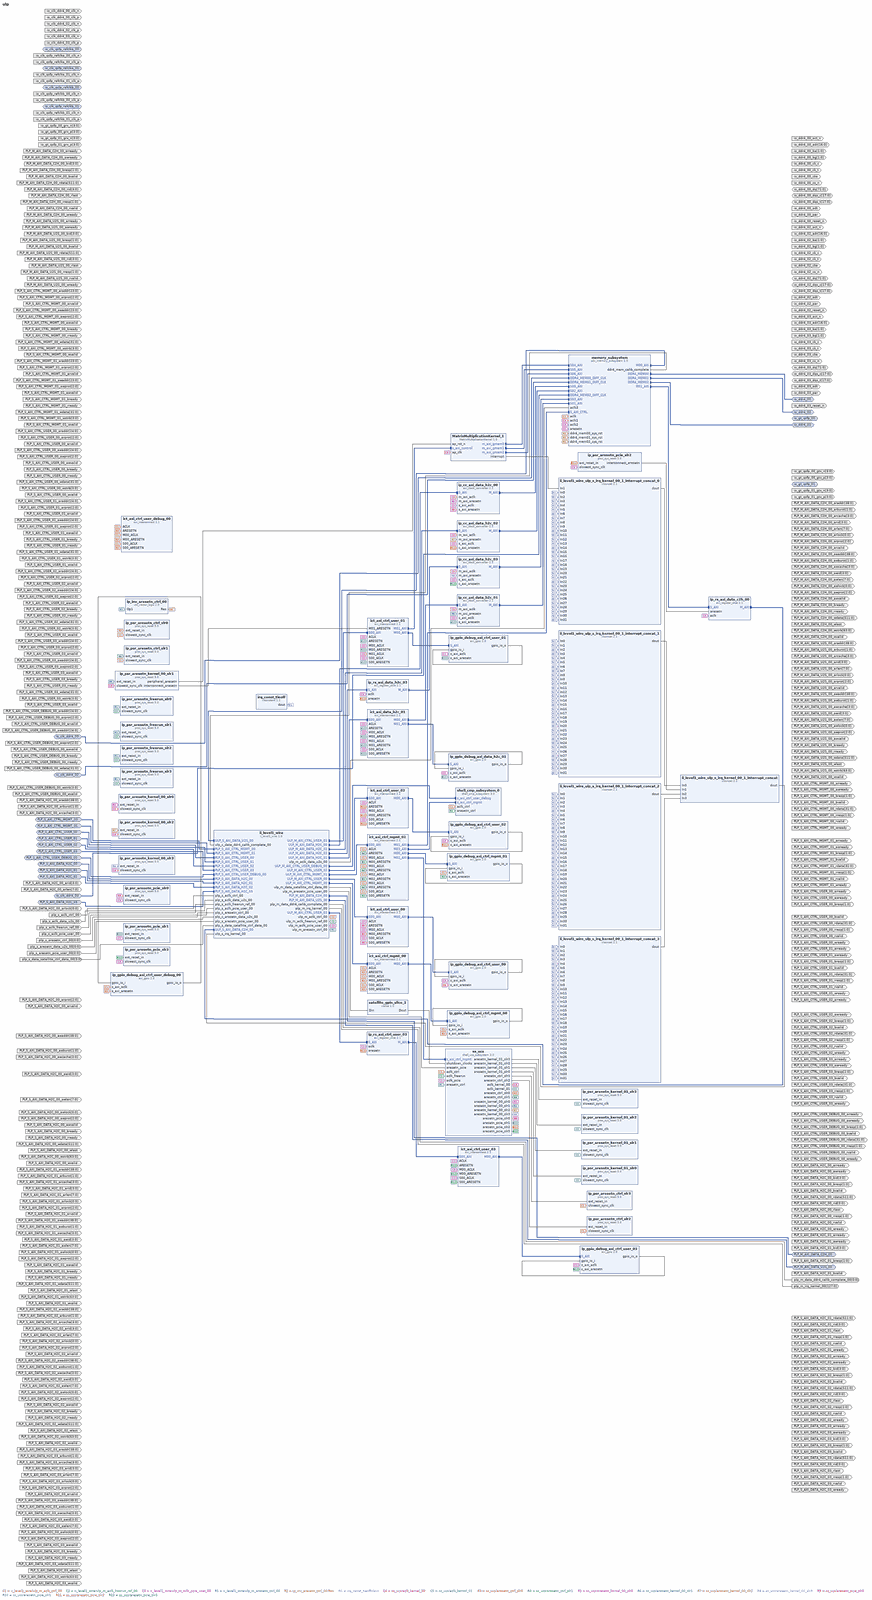
[diagram p0: block diagram of the top level, whole]
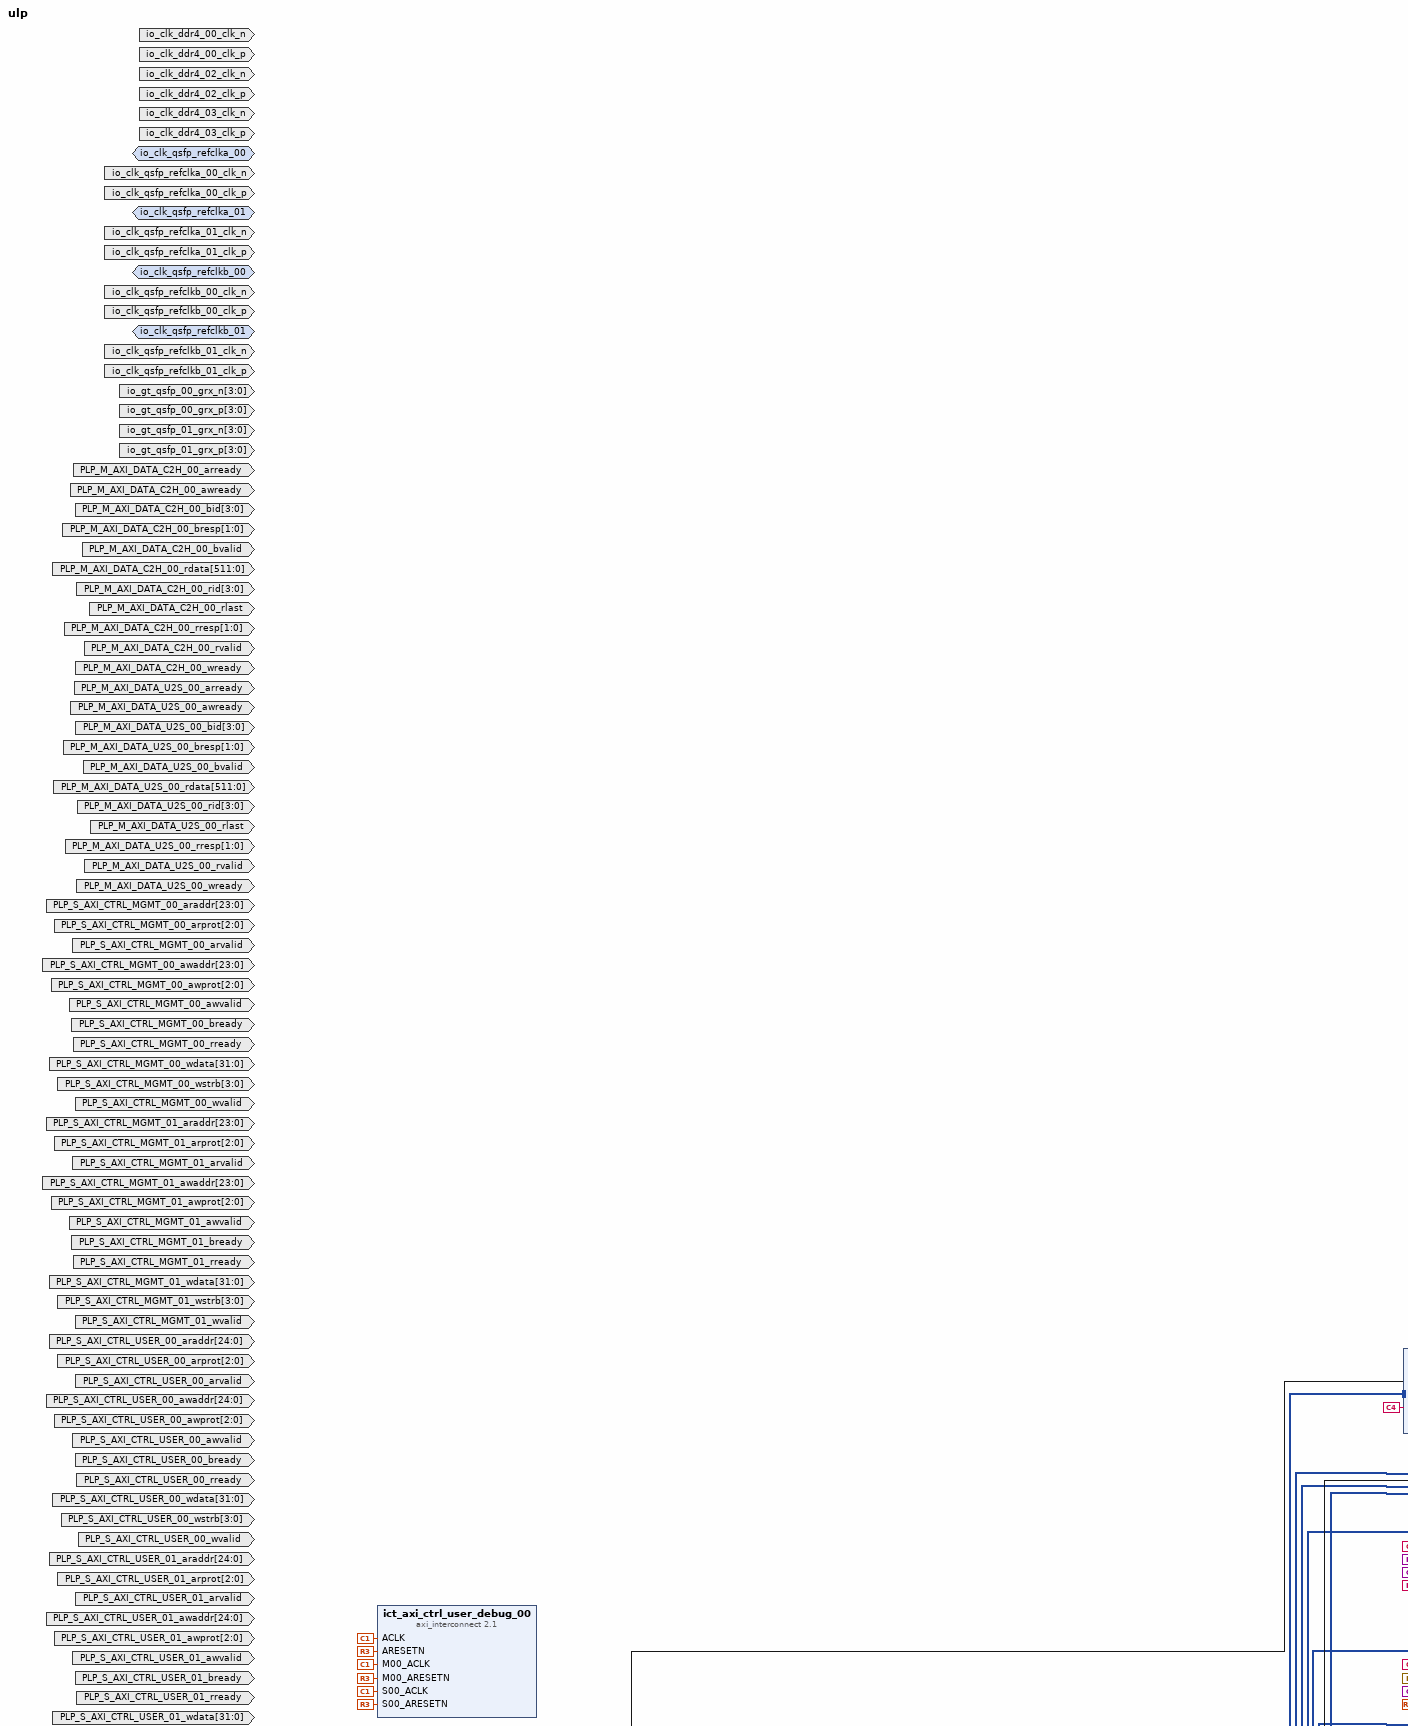
[diagram p1: block diagram of the top level, upper left part]
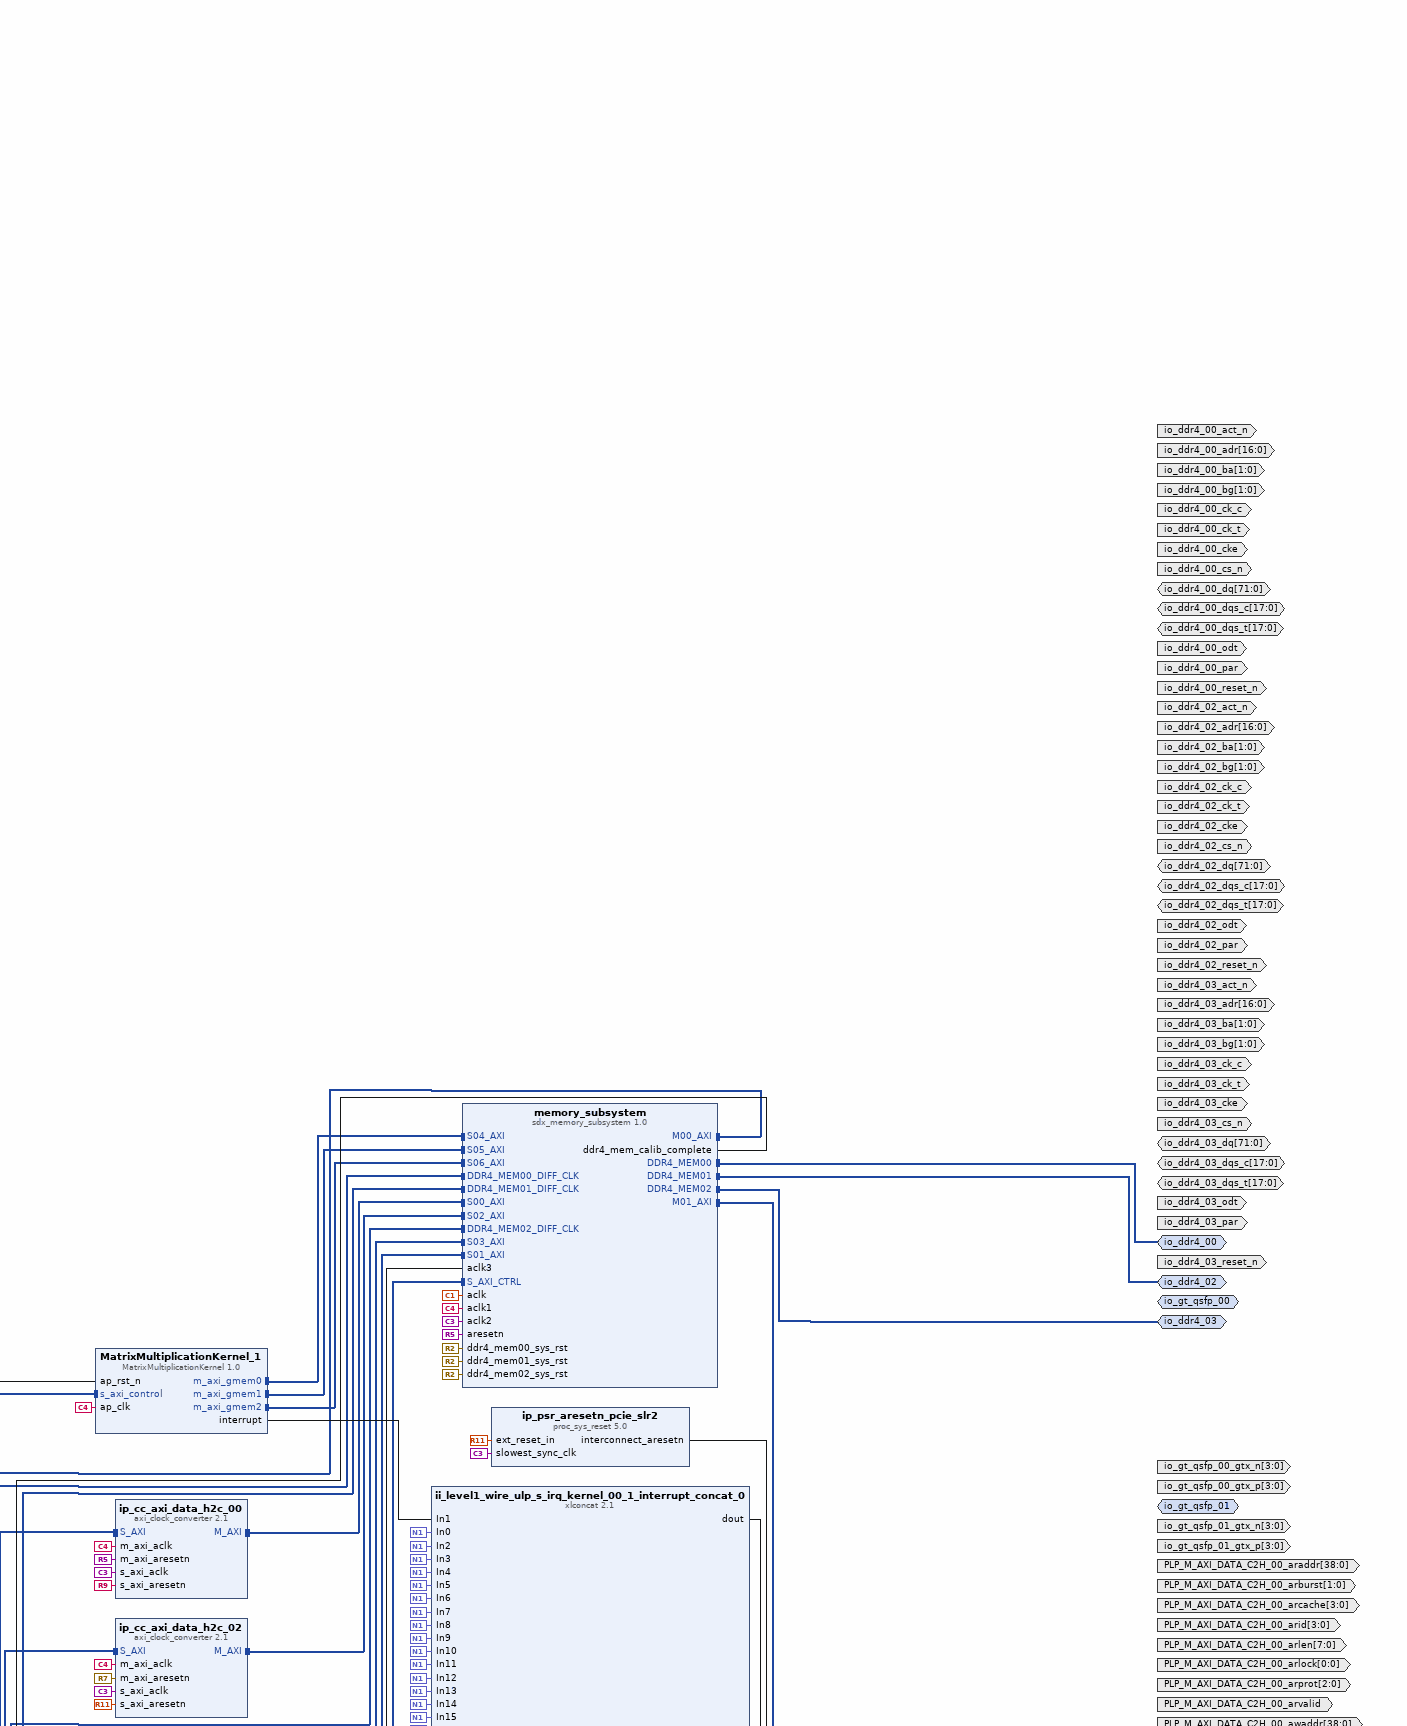
[diagram p2: block diagram of the top level, upper right part]
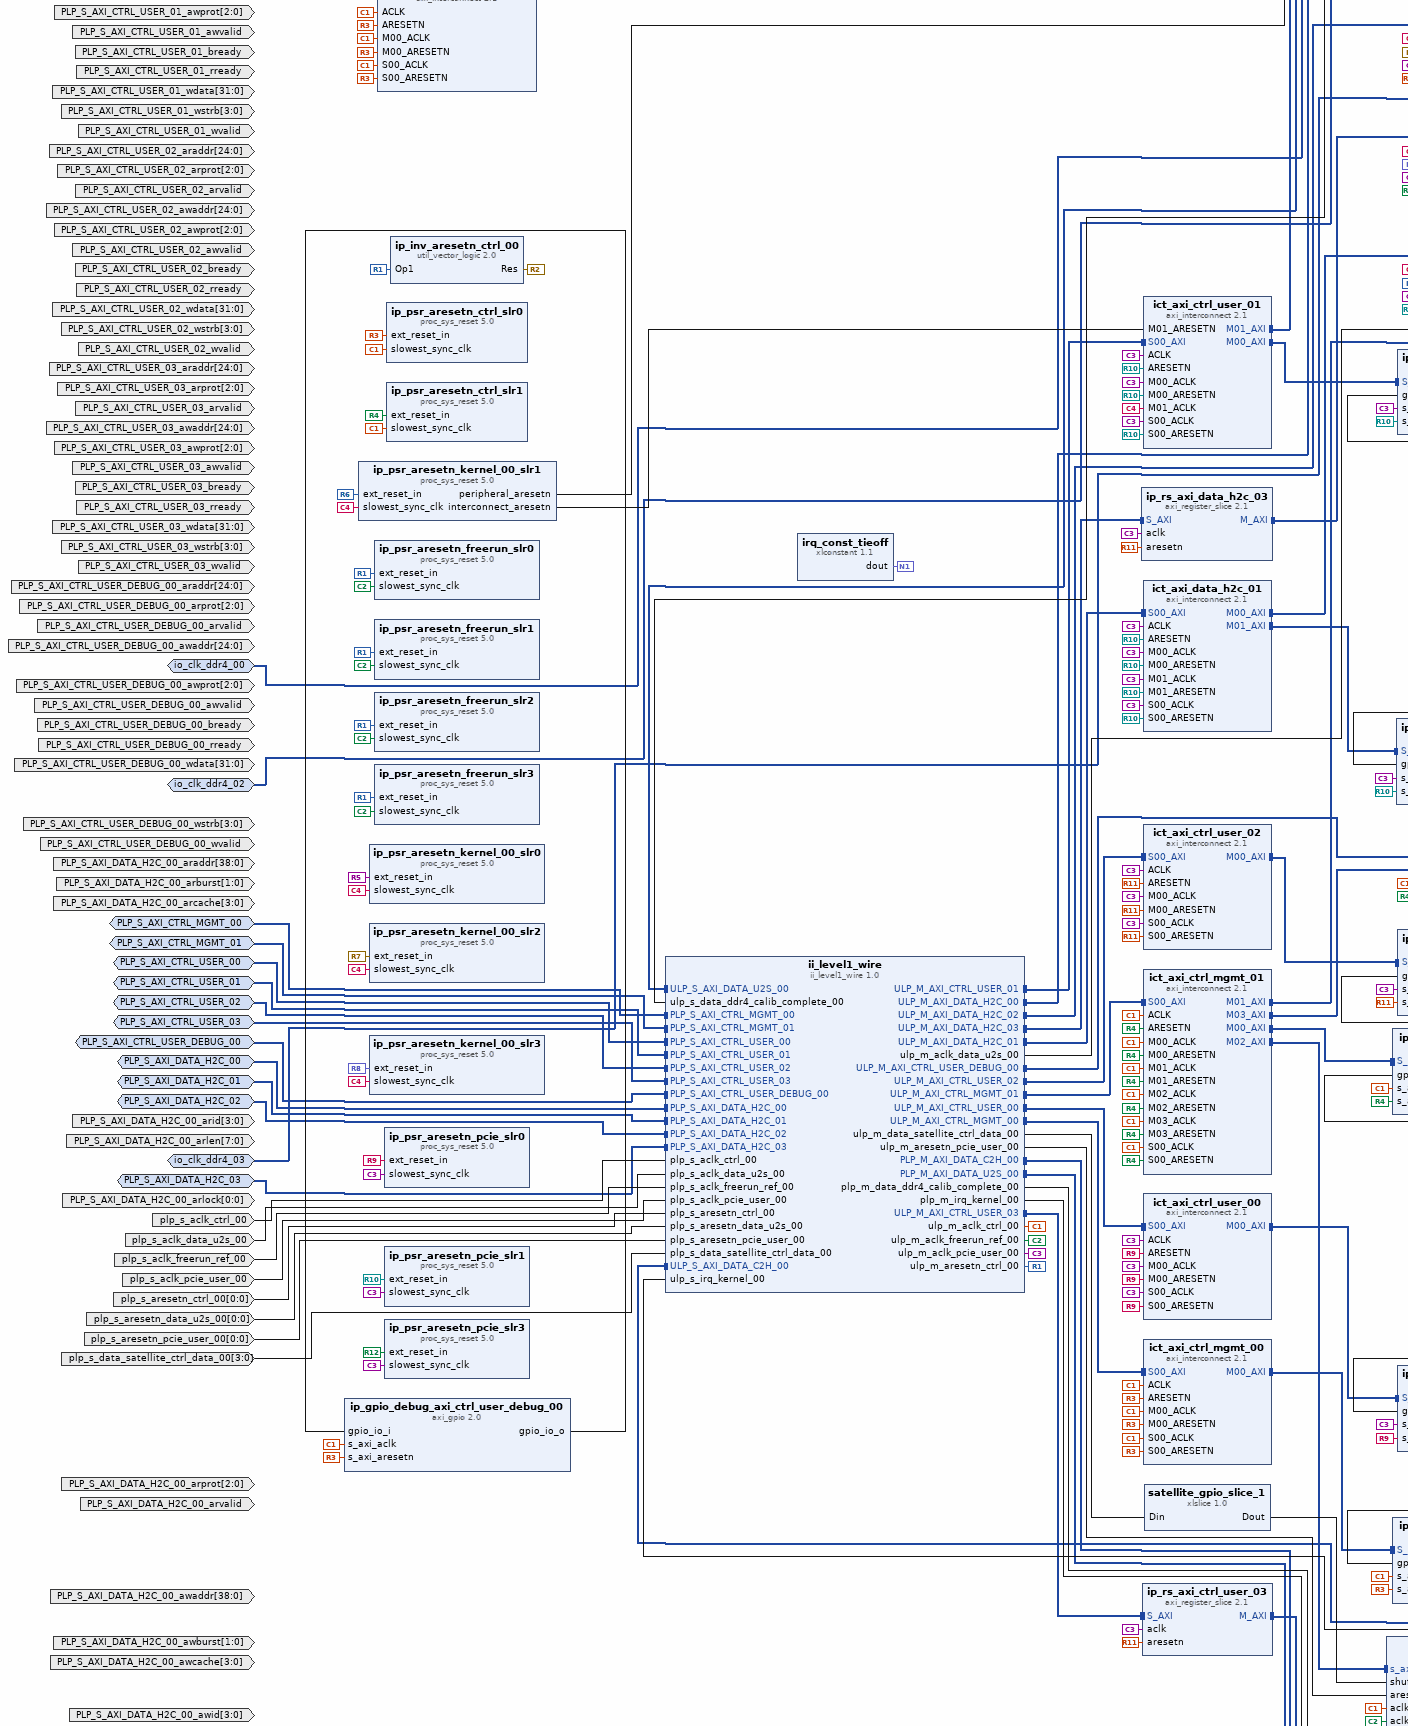
[diagram p3: block diagram of the top level, middle left part]
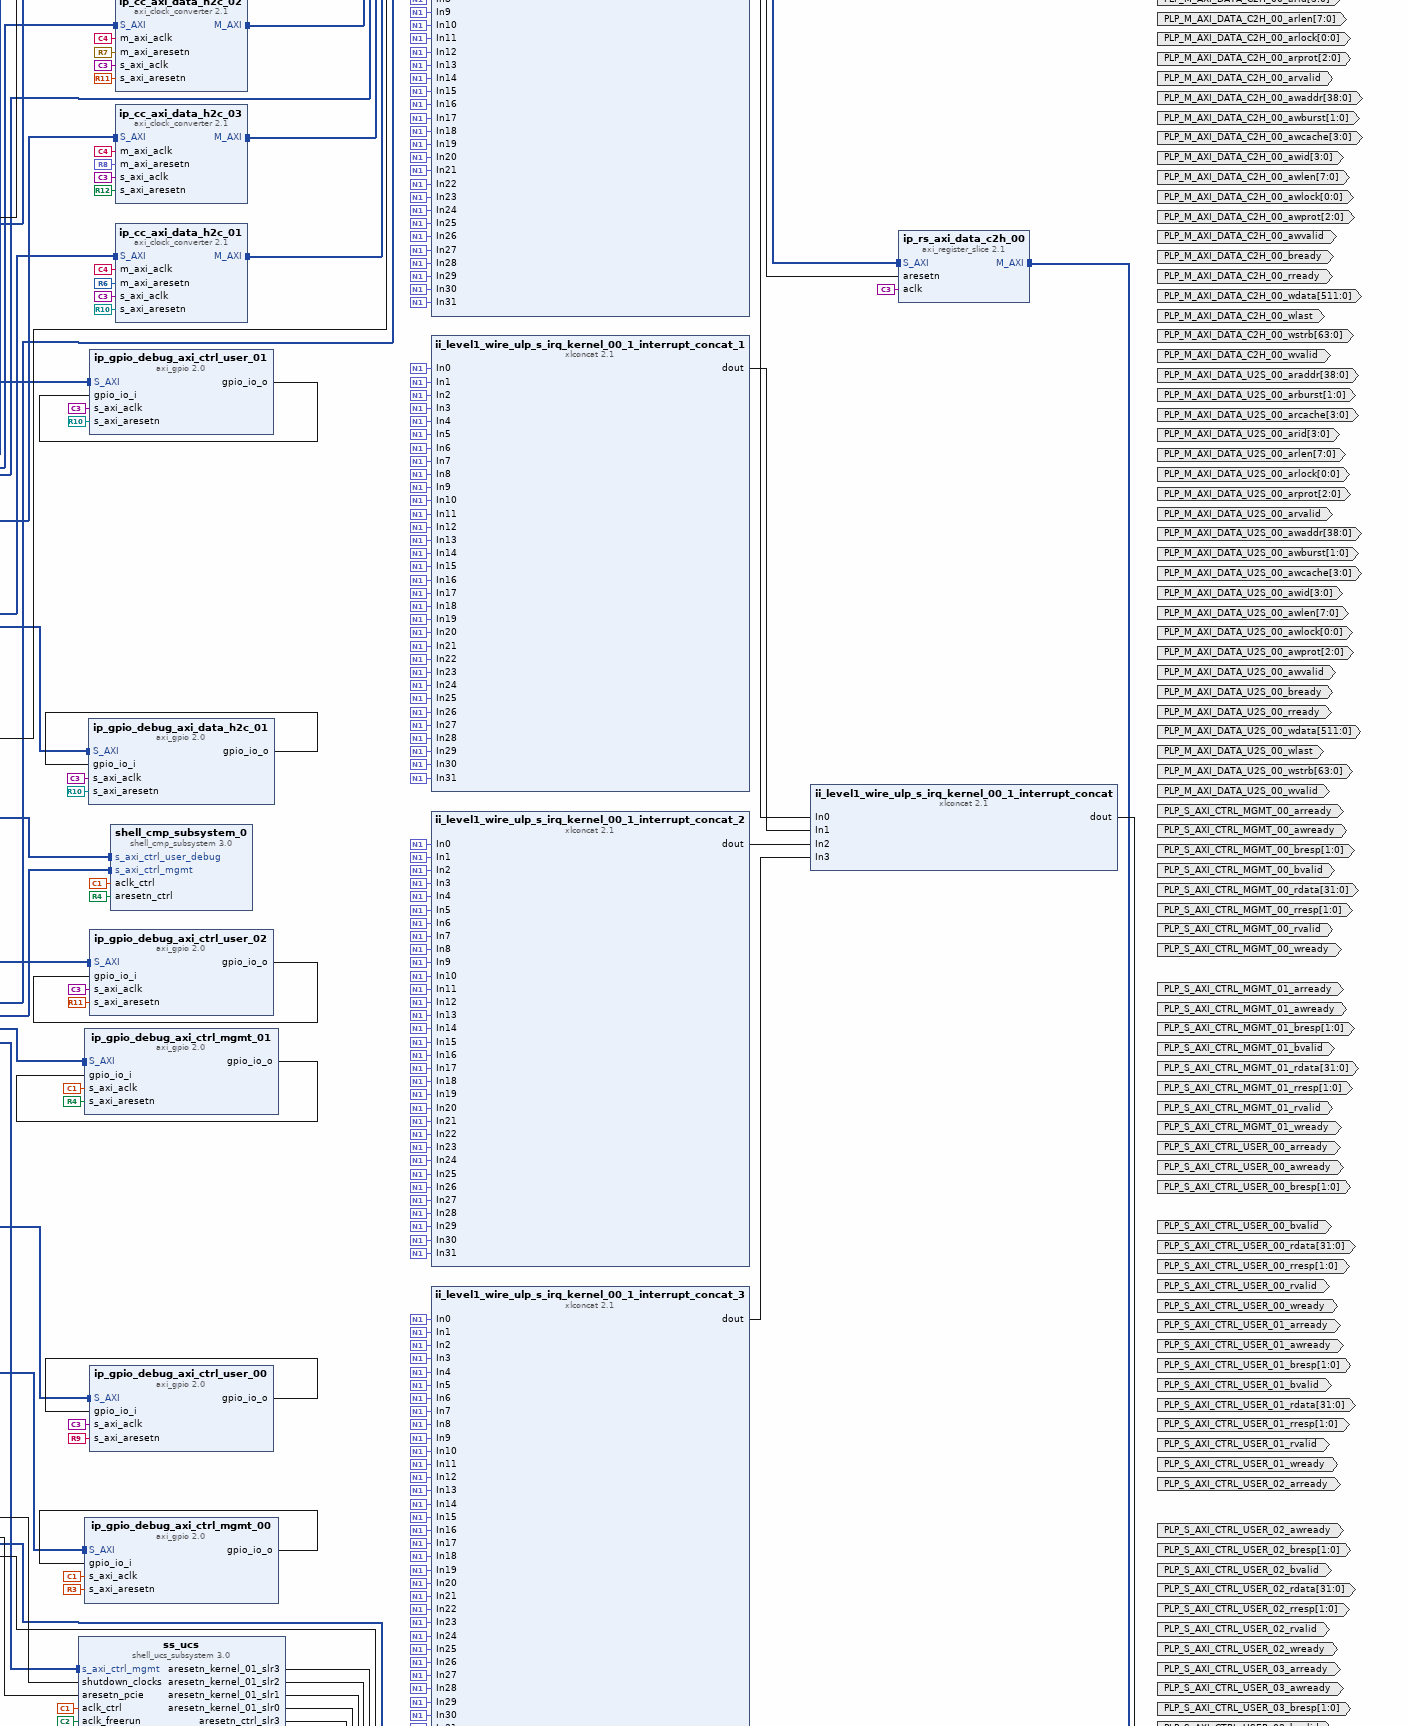
[diagram p4: block diagram of the top level, middle right part]
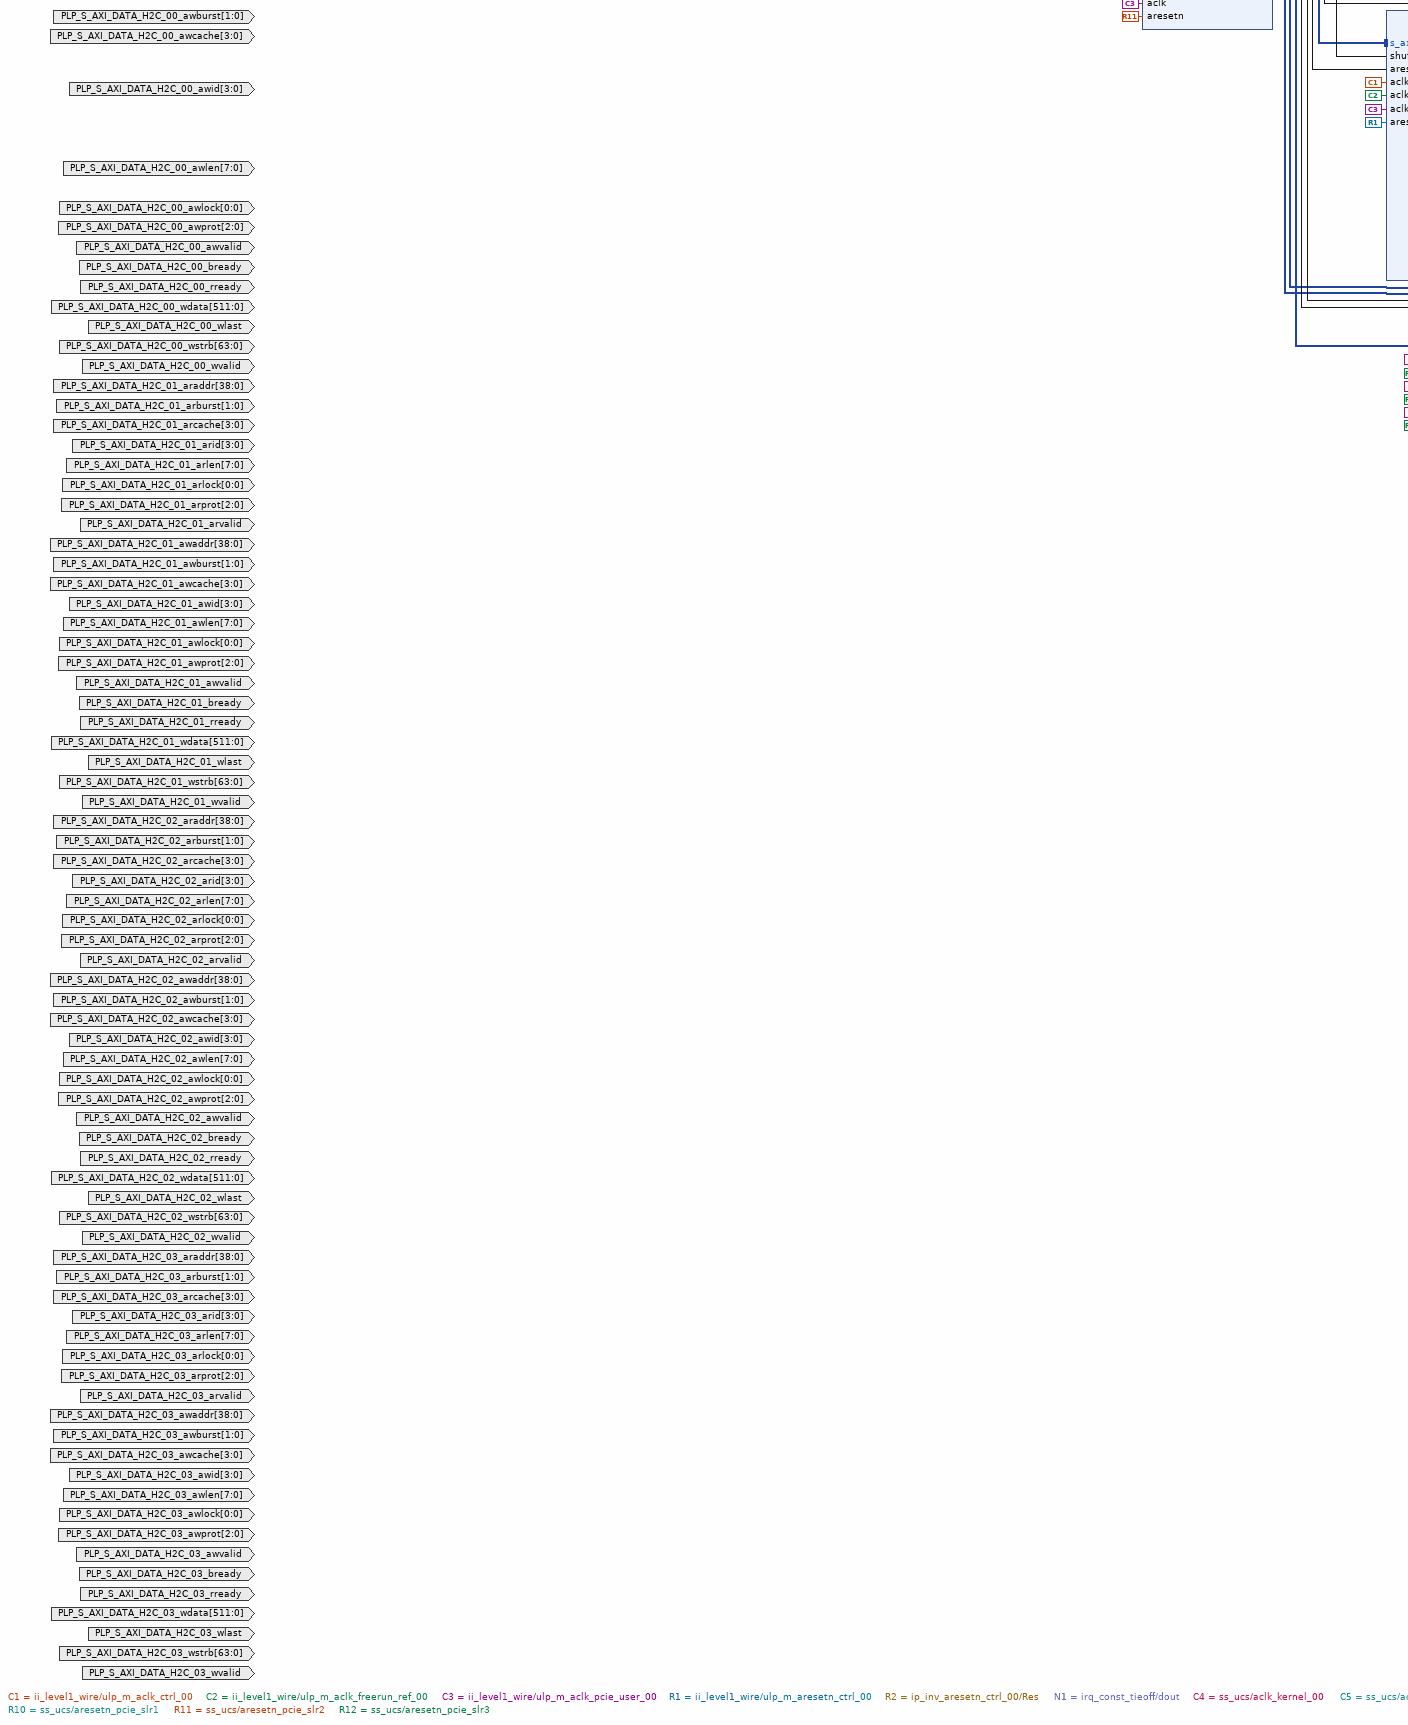
[diagram p5: block diagram of the top level, lower left part]
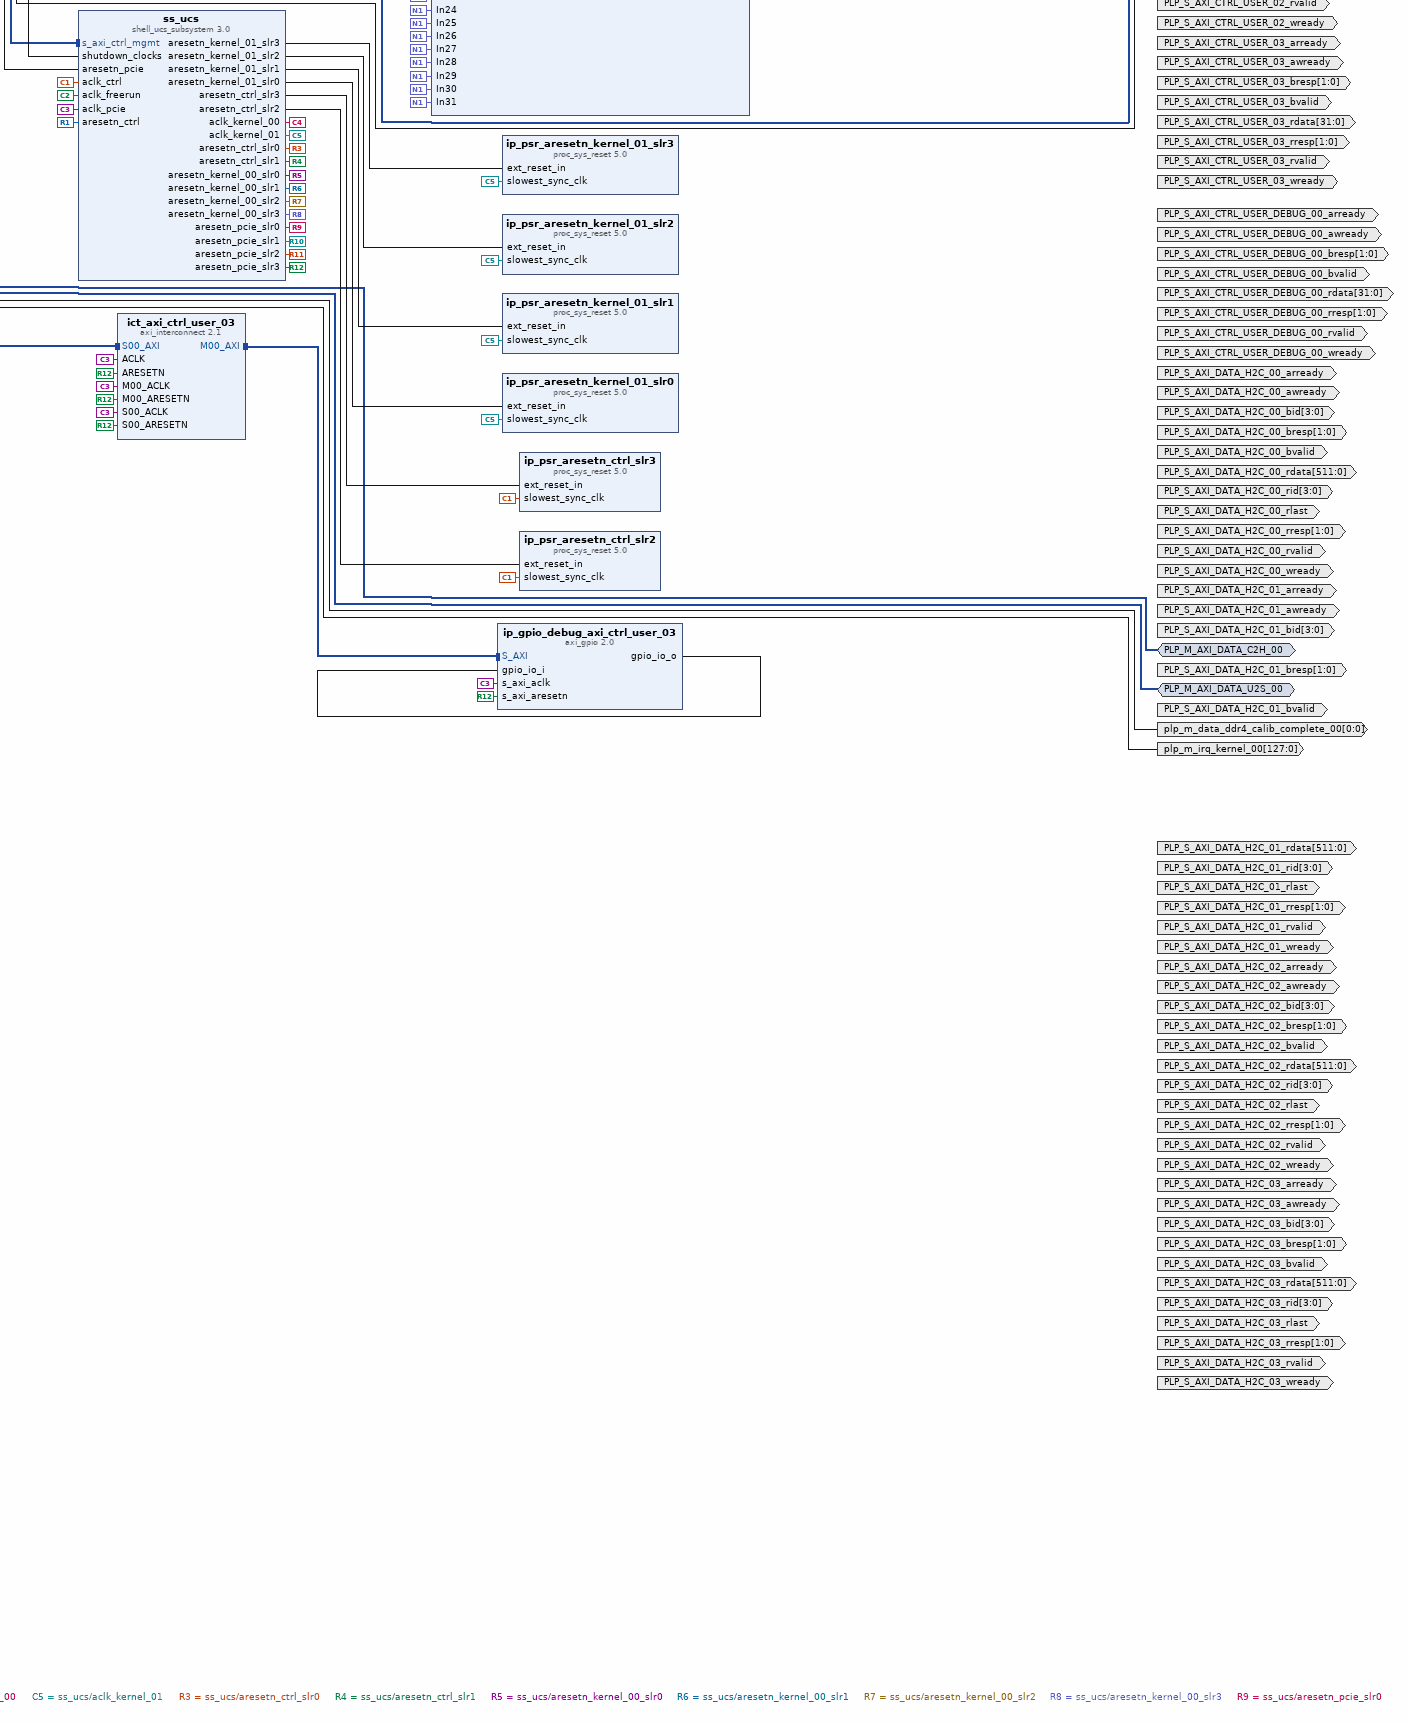
[diagram p6: block diagram of the top level, lower right part]
# Vivado block design ulp, xcu250-figd2104-2L-e, Vivado 2024.1
create_bd_design ulp

create_bd_intf_port -mode Master -vlnv xilinx.com:interface:ddr4_rtl:1.0 io_ddr4_00
create_bd_intf_port -mode Master -vlnv xilinx.com:interface:ddr4_rtl:1.0 io_ddr4_02
create_bd_intf_port -mode Master -vlnv xilinx.com:interface:ddr4_rtl:1.0 io_ddr4_03
create_bd_intf_port -mode Slave -vlnv xilinx.com:interface:diff_clock_rtl:1.0 io_clk_ddr4_00
set_property -dict {CONFIG.FREQ_HZ 300000000} [get_bd_intf_ports io_clk_ddr4_00]
create_bd_intf_port -mode Slave -vlnv xilinx.com:interface:diff_clock_rtl:1.0 io_clk_ddr4_02
set_property -dict {CONFIG.FREQ_HZ 300000000} [get_bd_intf_ports io_clk_ddr4_02]
create_bd_intf_port -mode Slave -vlnv xilinx.com:interface:diff_clock_rtl:1.0 io_clk_ddr4_03
set_property -dict {CONFIG.FREQ_HZ 300000000} [get_bd_intf_ports io_clk_ddr4_03]
create_bd_intf_port -mode Master -vlnv xilinx.com:interface:gt_rtl:1.0 io_gt_qsfp_00
create_bd_intf_port -mode Master -vlnv xilinx.com:interface:gt_rtl:1.0 io_gt_qsfp_01
create_bd_intf_port -mode Slave -vlnv xilinx.com:interface:diff_clock_rtl:1.0 io_clk_qsfp_refclka_00
create_bd_intf_port -mode Slave -vlnv xilinx.com:interface:diff_clock_rtl:1.0 io_clk_qsfp_refclka_01
create_bd_intf_port -mode Slave -vlnv xilinx.com:interface:diff_clock_rtl:1.0 io_clk_qsfp_refclkb_00
create_bd_intf_port -mode Slave -vlnv xilinx.com:interface:diff_clock_rtl:1.0 io_clk_qsfp_refclkb_01
create_bd_intf_port -mode Master -vlnv xilinx.com:interface:aximm_rtl:1.0 PLP_M_AXI_DATA_C2H_00
set_property -dict [list \
  CONFIG.ADDR_WIDTH 39 \
  CONFIG.CLK_DOMAIN cd_pcie_user_00 \
  CONFIG.DATA_WIDTH 512 \
  CONFIG.FREQ_HZ 250000000 \
  CONFIG.HAS_BRESP 1 \
  CONFIG.HAS_BURST 1 \
  CONFIG.HAS_CACHE 1 \
  CONFIG.HAS_LOCK 1 \
  CONFIG.HAS_PROT 1 \
  CONFIG.HAS_QOS 0 \
  CONFIG.HAS_REGION 0 \
  CONFIG.HAS_RRESP 1 \
  CONFIG.HAS_WSTRB 1 \
  CONFIG.INSERT_VIP 0 \
  CONFIG.NUM_READ_OUTSTANDING 64 \
  CONFIG.NUM_WRITE_OUTSTANDING 32 \
  CONFIG.PHASE 0 \
  CONFIG.PROTOCOL AXI4 \
  CONFIG.READ_WRITE_MODE READ_WRITE \
  CONFIG.SLR_ASSIGNMENT SLR2 \
] [get_bd_intf_ports PLP_M_AXI_DATA_C2H_00]
create_bd_intf_port -mode Master -vlnv xilinx.com:interface:aximm_rtl:1.0 PLP_M_AXI_DATA_U2S_00
set_property -dict [list \
  CONFIG.ADDR_WIDTH 39 \
  CONFIG.CLK_DOMAIN cd_data_u2s_00 \
  CONFIG.DATA_WIDTH 512 \
  CONFIG.FREQ_HZ 300000000 \
  CONFIG.HAS_BRESP 1 \
  CONFIG.HAS_BURST 1 \
  CONFIG.HAS_CACHE 1 \
  CONFIG.HAS_LOCK 1 \
  CONFIG.HAS_PROT 1 \
  CONFIG.HAS_QOS 0 \
  CONFIG.HAS_REGION 0 \
  CONFIG.HAS_RRESP 1 \
  CONFIG.HAS_WSTRB 1 \
  CONFIG.INSERT_VIP 0 \
  CONFIG.NUM_READ_OUTSTANDING 16 \
  CONFIG.NUM_WRITE_OUTSTANDING 32 \
  CONFIG.PHASE 0 \
  CONFIG.PROTOCOL AXI4 \
  CONFIG.READ_WRITE_MODE READ_WRITE \
  CONFIG.SLR_ASSIGNMENT SLR1 \
] [get_bd_intf_ports PLP_M_AXI_DATA_U2S_00]
create_bd_intf_port -mode Slave -vlnv xilinx.com:interface:aximm_rtl:1.0 PLP_S_AXI_CTRL_MGMT_00
set_property -dict [list \
  CONFIG.ADDR_WIDTH 24 \
  CONFIG.ARUSER_WIDTH 0 \
  CONFIG.AWUSER_WIDTH 0 \
  CONFIG.BUSER_WIDTH 0 \
  CONFIG.CLK_DOMAIN cd_ctrl_00 \
  CONFIG.DATA_WIDTH 32 \
  CONFIG.FREQ_HZ 50000000 \
  CONFIG.HAS_BRESP 1 \
  CONFIG.HAS_BURST 0 \
  CONFIG.HAS_CACHE 0 \
  CONFIG.HAS_LOCK 0 \
  CONFIG.HAS_PROT 1 \
  CONFIG.HAS_QOS 0 \
  CONFIG.HAS_REGION 0 \
  CONFIG.HAS_RRESP 1 \
  CONFIG.HAS_WSTRB 1 \
  CONFIG.ID_WIDTH 0 \
  CONFIG.INSERT_VIP 0 \
  CONFIG.MAX_BURST_LENGTH 1 \
  CONFIG.NUM_READ_OUTSTANDING 2 \
  CONFIG.NUM_READ_THREADS 1 \
  CONFIG.NUM_WRITE_OUTSTANDING 2 \
  CONFIG.NUM_WRITE_THREADS 1 \
  CONFIG.PHASE 0 \
  CONFIG.PROTOCOL AXI4LITE \
  CONFIG.READ_WRITE_MODE READ_WRITE \
  CONFIG.RUSER_BITS_PER_BYTE 0 \
  CONFIG.RUSER_WIDTH 0 \
  CONFIG.SLR_ASSIGNMENT SLR0 \
  CONFIG.SUPPORTS_NARROW_BURST 0 \
  CONFIG.WUSER_BITS_PER_BYTE 0 \
  CONFIG.WUSER_WIDTH 0 \
] [get_bd_intf_ports PLP_S_AXI_CTRL_MGMT_00]
create_bd_intf_port -mode Slave -vlnv xilinx.com:interface:aximm_rtl:1.0 PLP_S_AXI_CTRL_MGMT_01
set_property -dict [list \
  CONFIG.ADDR_WIDTH 24 \
  CONFIG.ARUSER_WIDTH 0 \
  CONFIG.AWUSER_WIDTH 0 \
  CONFIG.BUSER_WIDTH 0 \
  CONFIG.CLK_DOMAIN cd_ctrl_00 \
  CONFIG.DATA_WIDTH 32 \
  CONFIG.FREQ_HZ 50000000 \
  CONFIG.HAS_BRESP 1 \
  CONFIG.HAS_BURST 0 \
  CONFIG.HAS_CACHE 0 \
  CONFIG.HAS_LOCK 0 \
  CONFIG.HAS_PROT 1 \
  CONFIG.HAS_QOS 0 \
  CONFIG.HAS_REGION 0 \
  CONFIG.HAS_RRESP 1 \
  CONFIG.HAS_WSTRB 1 \
  CONFIG.ID_WIDTH 0 \
  CONFIG.INSERT_VIP 0 \
  CONFIG.MAX_BURST_LENGTH 1 \
  CONFIG.NUM_READ_OUTSTANDING 2 \
  CONFIG.NUM_READ_THREADS 1 \
  CONFIG.NUM_WRITE_OUTSTANDING 2 \
  CONFIG.NUM_WRITE_THREADS 1 \
  CONFIG.PHASE 0 \
  CONFIG.PROTOCOL AXI4LITE \
  CONFIG.READ_WRITE_MODE READ_WRITE \
  CONFIG.RUSER_BITS_PER_BYTE 0 \
  CONFIG.RUSER_WIDTH 0 \
  CONFIG.SLR_ASSIGNMENT SLR2 \
  CONFIG.SUPPORTS_NARROW_BURST 0 \
  CONFIG.WUSER_BITS_PER_BYTE 0 \
  CONFIG.WUSER_WIDTH 0 \
] [get_bd_intf_ports PLP_S_AXI_CTRL_MGMT_01]
create_bd_intf_port -mode Slave -vlnv xilinx.com:interface:aximm_rtl:1.0 PLP_S_AXI_CTRL_USER_00
set_property -dict [list \
  CONFIG.ADDR_WIDTH 25 \
  CONFIG.ARUSER_WIDTH 0 \
  CONFIG.AWUSER_WIDTH 0 \
  CONFIG.BUSER_WIDTH 0 \
  CONFIG.CLK_DOMAIN cd_pcie_user_00 \
  CONFIG.DATA_WIDTH 32 \
  CONFIG.FREQ_HZ 250000000 \
  CONFIG.HAS_BRESP 1 \
  CONFIG.HAS_BURST 0 \
  CONFIG.HAS_CACHE 0 \
  CONFIG.HAS_LOCK 0 \
  CONFIG.HAS_PROT 1 \
  CONFIG.HAS_QOS 0 \
  CONFIG.HAS_REGION 0 \
  CONFIG.HAS_RRESP 1 \
  CONFIG.HAS_WSTRB 1 \
  CONFIG.ID_WIDTH 0 \
  CONFIG.INSERT_VIP 0 \
  CONFIG.MAX_BURST_LENGTH 1 \
  CONFIG.NUM_READ_OUTSTANDING 2 \
  CONFIG.NUM_READ_THREADS 1 \
  CONFIG.NUM_WRITE_OUTSTANDING 2 \
  CONFIG.NUM_WRITE_THREADS 1 \
  CONFIG.PHASE 0 \
  CONFIG.PROTOCOL AXI4LITE \
  CONFIG.READ_WRITE_MODE READ_WRITE \
  CONFIG.RUSER_BITS_PER_BYTE 0 \
  CONFIG.RUSER_WIDTH 0 \
  CONFIG.SLR_ASSIGNMENT SLR0 \
  CONFIG.SUPPORTS_NARROW_BURST 0 \
  CONFIG.WUSER_BITS_PER_BYTE 0 \
  CONFIG.WUSER_WIDTH 0 \
] [get_bd_intf_ports PLP_S_AXI_CTRL_USER_00]
create_bd_intf_port -mode Slave -vlnv xilinx.com:interface:aximm_rtl:1.0 PLP_S_AXI_CTRL_USER_01
set_property -dict [list \
  CONFIG.ADDR_WIDTH 25 \
  CONFIG.ARUSER_WIDTH 0 \
  CONFIG.AWUSER_WIDTH 0 \
  CONFIG.BUSER_WIDTH 0 \
  CONFIG.CLK_DOMAIN cd_pcie_user_00 \
  CONFIG.DATA_WIDTH 32 \
  CONFIG.FREQ_HZ 250000000 \
  CONFIG.HAS_BRESP 1 \
  CONFIG.HAS_BURST 0 \
  CONFIG.HAS_CACHE 0 \
  CONFIG.HAS_LOCK 0 \
  CONFIG.HAS_PROT 1 \
  CONFIG.HAS_QOS 0 \
  CONFIG.HAS_REGION 0 \
  CONFIG.HAS_RRESP 1 \
  CONFIG.HAS_WSTRB 1 \
  CONFIG.ID_WIDTH 0 \
  CONFIG.INSERT_VIP 0 \
  CONFIG.MAX_BURST_LENGTH 1 \
  CONFIG.NUM_READ_OUTSTANDING 2 \
  CONFIG.NUM_READ_THREADS 1 \
  CONFIG.NUM_WRITE_OUTSTANDING 2 \
  CONFIG.NUM_WRITE_THREADS 1 \
  CONFIG.PHASE 0 \
  CONFIG.PROTOCOL AXI4LITE \
  CONFIG.READ_WRITE_MODE READ_WRITE \
  CONFIG.RUSER_BITS_PER_BYTE 0 \
  CONFIG.RUSER_WIDTH 0 \
  CONFIG.SLR_ASSIGNMENT SLR1 \
  CONFIG.SUPPORTS_NARROW_BURST 0 \
  CONFIG.WUSER_BITS_PER_BYTE 0 \
  CONFIG.WUSER_WIDTH 0 \
] [get_bd_intf_ports PLP_S_AXI_CTRL_USER_01]
create_bd_intf_port -mode Slave -vlnv xilinx.com:interface:aximm_rtl:1.0 PLP_S_AXI_CTRL_USER_02
set_property -dict [list \
  CONFIG.ADDR_WIDTH 25 \
  CONFIG.ARUSER_WIDTH 0 \
  CONFIG.AWUSER_WIDTH 0 \
  CONFIG.BUSER_WIDTH 0 \
  CONFIG.CLK_DOMAIN cd_pcie_user_00 \
  CONFIG.DATA_WIDTH 32 \
  CONFIG.FREQ_HZ 250000000 \
  CONFIG.HAS_BRESP 1 \
  CONFIG.HAS_BURST 0 \
  CONFIG.HAS_CACHE 0 \
  CONFIG.HAS_LOCK 0 \
  CONFIG.HAS_PROT 1 \
  CONFIG.HAS_QOS 0 \
  CONFIG.HAS_REGION 0 \
  CONFIG.HAS_RRESP 1 \
  CONFIG.HAS_WSTRB 1 \
  CONFIG.ID_WIDTH 0 \
  CONFIG.INSERT_VIP 0 \
  CONFIG.MAX_BURST_LENGTH 1 \
  CONFIG.NUM_READ_OUTSTANDING 2 \
  CONFIG.NUM_READ_THREADS 1 \
  CONFIG.NUM_WRITE_OUTSTANDING 2 \
  CONFIG.NUM_WRITE_THREADS 1 \
  CONFIG.PHASE 0 \
  CONFIG.PROTOCOL AXI4LITE \
  CONFIG.READ_WRITE_MODE READ_WRITE \
  CONFIG.RUSER_BITS_PER_BYTE 0 \
  CONFIG.RUSER_WIDTH 0 \
  CONFIG.SLR_ASSIGNMENT SLR2 \
  CONFIG.SUPPORTS_NARROW_BURST 0 \
  CONFIG.WUSER_BITS_PER_BYTE 0 \
  CONFIG.WUSER_WIDTH 0 \
] [get_bd_intf_ports PLP_S_AXI_CTRL_USER_02]
create_bd_intf_port -mode Slave -vlnv xilinx.com:interface:aximm_rtl:1.0 PLP_S_AXI_CTRL_USER_03
set_property -dict [list \
  CONFIG.ADDR_WIDTH 25 \
  CONFIG.ARUSER_WIDTH 0 \
  CONFIG.AWUSER_WIDTH 0 \
  CONFIG.BUSER_WIDTH 0 \
  CONFIG.CLK_DOMAIN cd_pcie_user_00 \
  CONFIG.DATA_WIDTH 32 \
  CONFIG.FREQ_HZ 250000000 \
  CONFIG.HAS_BRESP 1 \
  CONFIG.HAS_BURST 0 \
  CONFIG.HAS_CACHE 0 \
  CONFIG.HAS_LOCK 0 \
  CONFIG.HAS_PROT 1 \
  CONFIG.HAS_QOS 0 \
  CONFIG.HAS_REGION 0 \
  CONFIG.HAS_RRESP 1 \
  CONFIG.HAS_WSTRB 1 \
  CONFIG.ID_WIDTH 0 \
  CONFIG.INSERT_VIP 0 \
  CONFIG.MAX_BURST_LENGTH 1 \
  CONFIG.NUM_READ_OUTSTANDING 2 \
  CONFIG.NUM_READ_THREADS 1 \
  CONFIG.NUM_WRITE_OUTSTANDING 2 \
  CONFIG.NUM_WRITE_THREADS 1 \
  CONFIG.PHASE 0 \
  CONFIG.PROTOCOL AXI4LITE \
  CONFIG.READ_WRITE_MODE READ_WRITE \
  CONFIG.RUSER_BITS_PER_BYTE 0 \
  CONFIG.RUSER_WIDTH 0 \
  CONFIG.SLR_ASSIGNMENT SLR2 \
  CONFIG.SUPPORTS_NARROW_BURST 0 \
  CONFIG.WUSER_BITS_PER_BYTE 0 \
  CONFIG.WUSER_WIDTH 0 \
] [get_bd_intf_ports PLP_S_AXI_CTRL_USER_03]
create_bd_intf_port -mode Slave -vlnv xilinx.com:interface:aximm_rtl:1.0 PLP_S_AXI_CTRL_USER_DEBUG_00
set_property -dict [list \
  CONFIG.ADDR_WIDTH 25 \
  CONFIG.ARUSER_WIDTH 0 \
  CONFIG.AWUSER_WIDTH 0 \
  CONFIG.BUSER_WIDTH 0 \
  CONFIG.CLK_DOMAIN cd_ctrl_00 \
  CONFIG.DATA_WIDTH 32 \
  CONFIG.FREQ_HZ 50000000 \
  CONFIG.HAS_BRESP 1 \
  CONFIG.HAS_BURST 0 \
  CONFIG.HAS_CACHE 0 \
  CONFIG.HAS_LOCK 0 \
  CONFIG.HAS_PROT 1 \
  CONFIG.HAS_QOS 0 \
  CONFIG.HAS_REGION 1 \
  CONFIG.HAS_RRESP 1 \
  CONFIG.HAS_WSTRB 1 \
  CONFIG.ID_WIDTH 0 \
  CONFIG.INSERT_VIP 0 \
  CONFIG.MAX_BURST_LENGTH 1 \
  CONFIG.NUM_READ_OUTSTANDING 2 \
  CONFIG.NUM_READ_THREADS 1 \
  CONFIG.NUM_WRITE_OUTSTANDING 2 \
  CONFIG.NUM_WRITE_THREADS 1 \
  CONFIG.PHASE 0 \
  CONFIG.PROTOCOL AXI4LITE \
  CONFIG.READ_WRITE_MODE READ_WRITE \
  CONFIG.RUSER_BITS_PER_BYTE 0 \
  CONFIG.RUSER_WIDTH 0 \
  CONFIG.SUPPORTS_NARROW_BURST 0 \
  CONFIG.WUSER_BITS_PER_BYTE 0 \
  CONFIG.WUSER_WIDTH 0 \
] [get_bd_intf_ports PLP_S_AXI_CTRL_USER_DEBUG_00]
create_bd_intf_port -mode Slave -vlnv xilinx.com:interface:aximm_rtl:1.0 PLP_S_AXI_DATA_H2C_00
set_property -dict [list \
  CONFIG.ADDR_WIDTH 39 \
  CONFIG.ARUSER_WIDTH 0 \
  CONFIG.AWUSER_WIDTH 0 \
  CONFIG.BUSER_WIDTH 0 \
  CONFIG.CLK_DOMAIN cd_pcie_user_00 \
  CONFIG.DATA_WIDTH 512 \
  CONFIG.FREQ_HZ 250000000 \
  CONFIG.HAS_BRESP 1 \
  CONFIG.HAS_BURST 1 \
  CONFIG.HAS_CACHE 1 \
  CONFIG.HAS_LOCK 1 \
  CONFIG.HAS_PROT 1 \
  CONFIG.HAS_QOS 0 \
  CONFIG.HAS_REGION 0 \
  CONFIG.HAS_RRESP 1 \
  CONFIG.HAS_WSTRB 1 \
  CONFIG.ID_WIDTH 4 \
  CONFIG.INSERT_VIP 0 \
  CONFIG.MAX_BURST_LENGTH 256 \
  CONFIG.NUM_READ_OUTSTANDING 16 \
  CONFIG.NUM_READ_THREADS 2 \
  CONFIG.NUM_WRITE_OUTSTANDING 32 \
  CONFIG.NUM_WRITE_THREADS 2 \
  CONFIG.PHASE 0 \
  CONFIG.PROTOCOL AXI4 \
  CONFIG.READ_WRITE_MODE READ_WRITE \
  CONFIG.RUSER_BITS_PER_BYTE 0 \
  CONFIG.RUSER_WIDTH 0 \
  CONFIG.SLR_ASSIGNMENT SLR0 \
  CONFIG.SUPPORTS_NARROW_BURST 0 \
  CONFIG.WUSER_BITS_PER_BYTE 0 \
  CONFIG.WUSER_WIDTH 0 \
] [get_bd_intf_ports PLP_S_AXI_DATA_H2C_00]
create_bd_intf_port -mode Slave -vlnv xilinx.com:interface:aximm_rtl:1.0 PLP_S_AXI_DATA_H2C_01
set_property -dict [list \
  CONFIG.ADDR_WIDTH 39 \
  CONFIG.ARUSER_WIDTH 0 \
  CONFIG.AWUSER_WIDTH 0 \
  CONFIG.BUSER_WIDTH 0 \
  CONFIG.CLK_DOMAIN cd_pcie_user_00 \
  CONFIG.DATA_WIDTH 512 \
  CONFIG.FREQ_HZ 250000000 \
  CONFIG.HAS_BRESP 1 \
  CONFIG.HAS_BURST 1 \
  CONFIG.HAS_CACHE 1 \
  CONFIG.HAS_LOCK 1 \
  CONFIG.HAS_PROT 1 \
  CONFIG.HAS_QOS 0 \
  CONFIG.HAS_REGION 0 \
  CONFIG.HAS_RRESP 1 \
  CONFIG.HAS_WSTRB 1 \
  CONFIG.ID_WIDTH 4 \
  CONFIG.INSERT_VIP 0 \
  CONFIG.MAX_BURST_LENGTH 256 \
  CONFIG.NUM_READ_OUTSTANDING 16 \
  CONFIG.NUM_READ_THREADS 2 \
  CONFIG.NUM_WRITE_OUTSTANDING 32 \
  CONFIG.NUM_WRITE_THREADS 2 \
  CONFIG.PHASE 0 \
  CONFIG.PROTOCOL AXI4 \
  CONFIG.READ_WRITE_MODE READ_WRITE \
  CONFIG.RUSER_BITS_PER_BYTE 0 \
  CONFIG.RUSER_WIDTH 0 \
  CONFIG.SLR_ASSIGNMENT SLR1 \
  CONFIG.SUPPORTS_NARROW_BURST 0 \
  CONFIG.WUSER_BITS_PER_BYTE 0 \
  CONFIG.WUSER_WIDTH 0 \
] [get_bd_intf_ports PLP_S_AXI_DATA_H2C_01]
create_bd_intf_port -mode Slave -vlnv xilinx.com:interface:aximm_rtl:1.0 PLP_S_AXI_DATA_H2C_02
set_property -dict [list \
  CONFIG.ADDR_WIDTH 39 \
  CONFIG.ARUSER_WIDTH 0 \
  CONFIG.AWUSER_WIDTH 0 \
  CONFIG.BUSER_WIDTH 0 \
  CONFIG.CLK_DOMAIN cd_pcie_user_00 \
  CONFIG.DATA_WIDTH 512 \
  CONFIG.FREQ_HZ 250000000 \
  CONFIG.HAS_BRESP 1 \
  CONFIG.HAS_BURST 1 \
  CONFIG.HAS_CACHE 1 \
  CONFIG.HAS_LOCK 1 \
  CONFIG.HAS_PROT 1 \
  CONFIG.HAS_QOS 0 \
  CONFIG.HAS_REGION 0 \
  CONFIG.HAS_RRESP 1 \
  CONFIG.HAS_WSTRB 1 \
  CONFIG.ID_WIDTH 4 \
  CONFIG.INSERT_VIP 0 \
  CONFIG.MAX_BURST_LENGTH 256 \
  CONFIG.NUM_READ_OUTSTANDING 16 \
  CONFIG.NUM_READ_THREADS 2 \
  CONFIG.NUM_WRITE_OUTSTANDING 32 \
  CONFIG.NUM_WRITE_THREADS 2 \
  CONFIG.PHASE 0 \
  CONFIG.PROTOCOL AXI4 \
  CONFIG.READ_WRITE_MODE READ_WRITE \
  CONFIG.RUSER_BITS_PER_BYTE 0 \
  CONFIG.RUSER_WIDTH 0 \
  CONFIG.SLR_ASSIGNMENT SLR2 \
  CONFIG.SUPPORTS_NARROW_BURST 0 \
  CONFIG.WUSER_BITS_PER_BYTE 0 \
  CONFIG.WUSER_WIDTH 0 \
] [get_bd_intf_ports PLP_S_AXI_DATA_H2C_02]
create_bd_intf_port -mode Slave -vlnv xilinx.com:interface:aximm_rtl:1.0 PLP_S_AXI_DATA_H2C_03
set_property -dict [list \
  CONFIG.ADDR_WIDTH 39 \
  CONFIG.ARUSER_WIDTH 0 \
  CONFIG.AWUSER_WIDTH 0 \
  CONFIG.BUSER_WIDTH 0 \
  CONFIG.CLK_DOMAIN cd_pcie_user_00 \
  CONFIG.DATA_WIDTH 512 \
  CONFIG.FREQ_HZ 250000000 \
  CONFIG.HAS_BRESP 1 \
  CONFIG.HAS_BURST 1 \
  CONFIG.HAS_CACHE 1 \
  CONFIG.HAS_LOCK 1 \
  CONFIG.HAS_PROT 1 \
  CONFIG.HAS_QOS 0 \
  CONFIG.HAS_REGION 0 \
  CONFIG.HAS_RRESP 1 \
  CONFIG.HAS_WSTRB 1 \
  CONFIG.ID_WIDTH 4 \
  CONFIG.INSERT_VIP 0 \
  CONFIG.MAX_BURST_LENGTH 256 \
  CONFIG.NUM_READ_OUTSTANDING 16 \
  CONFIG.NUM_READ_THREADS 2 \
  CONFIG.NUM_WRITE_OUTSTANDING 32 \
  CONFIG.NUM_WRITE_THREADS 2 \
  CONFIG.PHASE 0 \
  CONFIG.PROTOCOL AXI4 \
  CONFIG.READ_WRITE_MODE READ_WRITE \
  CONFIG.RUSER_BITS_PER_BYTE 0 \
  CONFIG.RUSER_WIDTH 0 \
  CONFIG.SLR_ASSIGNMENT SLR2 \
  CONFIG.SUPPORTS_NARROW_BURST 0 \
  CONFIG.WUSER_BITS_PER_BYTE 0 \
  CONFIG.WUSER_WIDTH 0 \
] [get_bd_intf_ports PLP_S_AXI_DATA_H2C_03]
create_bd_port -dir O io_ddr4_00_act_n
create_bd_port -dir O io_ddr4_00_par
create_bd_port -dir O -from 16 -to 0 io_ddr4_00_adr
create_bd_port -dir O -from 1 -to 0 io_ddr4_00_ba
create_bd_port -dir O -from 1 -to 0 io_ddr4_00_bg
create_bd_port -dir O io_ddr4_00_ck_c
create_bd_port -dir O io_ddr4_00_ck_t
create_bd_port -dir O io_ddr4_00_cke
create_bd_port -dir O io_ddr4_00_cs_n
create_bd_port -dir IO -from 71 -to 0 io_ddr4_00_dq
create_bd_port -dir IO -from 17 -to 0 io_ddr4_00_dqs_c
create_bd_port -dir IO -from 17 -to 0 io_ddr4_00_dqs_t
create_bd_port -dir O io_ddr4_00_odt
create_bd_port -dir O io_ddr4_00_reset_n
create_bd_port -dir O io_ddr4_02_act_n
create_bd_port -dir O io_ddr4_02_par
create_bd_port -dir O -from 16 -to 0 io_ddr4_02_adr
create_bd_port -dir O -from 1 -to 0 io_ddr4_02_ba
create_bd_port -dir O -from 1 -to 0 io_ddr4_02_bg
create_bd_port -dir O io_ddr4_02_ck_c
create_bd_port -dir O io_ddr4_02_ck_t
create_bd_port -dir O io_ddr4_02_cke
create_bd_port -dir O io_ddr4_02_cs_n
create_bd_port -dir IO -from 71 -to 0 io_ddr4_02_dq
create_bd_port -dir IO -from 17 -to 0 io_ddr4_02_dqs_c
create_bd_port -dir IO -from 17 -to 0 io_ddr4_02_dqs_t
create_bd_port -dir O io_ddr4_02_odt
create_bd_port -dir O io_ddr4_02_reset_n
create_bd_port -dir O io_ddr4_03_act_n
create_bd_port -dir O io_ddr4_03_par
create_bd_port -dir O -from 16 -to 0 io_ddr4_03_adr
create_bd_port -dir O -from 1 -to 0 io_ddr4_03_ba
create_bd_port -dir O -from 1 -to 0 io_ddr4_03_bg
create_bd_port -dir O io_ddr4_03_ck_c
create_bd_port -dir O io_ddr4_03_ck_t
create_bd_port -dir O io_ddr4_03_cke
create_bd_port -dir O io_ddr4_03_cs_n
create_bd_port -dir IO -from 71 -to 0 io_ddr4_03_dq
create_bd_port -dir IO -from 17 -to 0 io_ddr4_03_dqs_c
create_bd_port -dir IO -from 17 -to 0 io_ddr4_03_dqs_t
create_bd_port -dir O io_ddr4_03_odt
create_bd_port -dir O io_ddr4_03_reset_n
create_bd_port -dir I io_clk_ddr4_00_clk_p
create_bd_port -dir I io_clk_ddr4_00_clk_n
create_bd_port -dir I io_clk_ddr4_02_clk_p
create_bd_port -dir I io_clk_ddr4_02_clk_n
create_bd_port -dir I io_clk_ddr4_03_clk_p
create_bd_port -dir I io_clk_ddr4_03_clk_n
create_bd_port -dir O -from 3 -to 0 io_gt_qsfp_00_gtx_n
create_bd_port -dir O -from 3 -to 0 io_gt_qsfp_00_gtx_p
create_bd_port -dir I -from 3 -to 0 io_gt_qsfp_00_grx_n
create_bd_port -dir I -from 3 -to 0 io_gt_qsfp_00_grx_p
create_bd_port -dir O -from 3 -to 0 io_gt_qsfp_01_gtx_n
create_bd_port -dir O -from 3 -to 0 io_gt_qsfp_01_gtx_p
create_bd_port -dir I -from 3 -to 0 io_gt_qsfp_01_grx_n
create_bd_port -dir I -from 3 -to 0 io_gt_qsfp_01_grx_p
create_bd_port -dir I io_clk_qsfp_refclka_00_clk_p
create_bd_port -dir I io_clk_qsfp_refclka_00_clk_n
create_bd_port -dir I io_clk_qsfp_refclka_01_clk_p
create_bd_port -dir I io_clk_qsfp_refclka_01_clk_n
create_bd_port -dir I io_clk_qsfp_refclkb_00_clk_p
create_bd_port -dir I io_clk_qsfp_refclkb_00_clk_n
create_bd_port -dir I io_clk_qsfp_refclkb_01_clk_p
create_bd_port -dir I io_clk_qsfp_refclkb_01_clk_n
create_bd_port -dir O -from 38 -to 0 PLP_M_AXI_DATA_C2H_00_araddr
create_bd_port -dir O -from 1 -to 0 PLP_M_AXI_DATA_C2H_00_arburst
create_bd_port -dir O -from 3 -to 0 PLP_M_AXI_DATA_C2H_00_arcache
create_bd_port -dir O -from 3 -to 0 PLP_M_AXI_DATA_C2H_00_arid
create_bd_port -dir O -from 7 -to 0 PLP_M_AXI_DATA_C2H_00_arlen
create_bd_port -dir O -from 0 -to 0 PLP_M_AXI_DATA_C2H_00_arlock
create_bd_port -dir O -from 2 -to 0 PLP_M_AXI_DATA_C2H_00_arprot
create_bd_port -dir I PLP_M_AXI_DATA_C2H_00_arready
create_bd_port -dir O PLP_M_AXI_DATA_C2H_00_arvalid
create_bd_port -dir O -from 38 -to 0 PLP_M_AXI_DATA_C2H_00_awaddr
create_bd_port -dir O -from 1 -to 0 PLP_M_AXI_DATA_C2H_00_awburst
create_bd_port -dir O -from 3 -to 0 PLP_M_AXI_DATA_C2H_00_awcache
create_bd_port -dir O -from 3 -to 0 PLP_M_AXI_DATA_C2H_00_awid
create_bd_port -dir O -from 7 -to 0 PLP_M_AXI_DATA_C2H_00_awlen
create_bd_port -dir O -from 0 -to 0 PLP_M_AXI_DATA_C2H_00_awlock
create_bd_port -dir O -from 2 -to 0 PLP_M_AXI_DATA_C2H_00_awprot
create_bd_port -dir I PLP_M_AXI_DATA_C2H_00_awready
create_bd_port -dir O PLP_M_AXI_DATA_C2H_00_awvalid
create_bd_port -dir I -from 3 -to 0 PLP_M_AXI_DATA_C2H_00_bid
create_bd_port -dir O PLP_M_AXI_DATA_C2H_00_bready
create_bd_port -dir I -from 1 -to 0 PLP_M_AXI_DATA_C2H_00_bresp
create_bd_port -dir I PLP_M_AXI_DATA_C2H_00_bvalid
create_bd_port -dir I -from 511 -to 0 PLP_M_AXI_DATA_C2H_00_rdata
create_bd_port -dir I -from 3 -to 0 PLP_M_AXI_DATA_C2H_00_rid
create_bd_port -dir I PLP_M_AXI_DATA_C2H_00_rlast
create_bd_port -dir O PLP_M_AXI_DATA_C2H_00_rready
create_bd_port -dir I -from 1 -to 0 PLP_M_AXI_DATA_C2H_00_rresp
create_bd_port -dir I PLP_M_AXI_DATA_C2H_00_rvalid
create_bd_port -dir O -from 511 -to 0 PLP_M_AXI_DATA_C2H_00_wdata
create_bd_port -dir O PLP_M_AXI_DATA_C2H_00_wlast
create_bd_port -dir I PLP_M_AXI_DATA_C2H_00_wready
create_bd_port -dir O -from 63 -to 0 PLP_M_AXI_DATA_C2H_00_wstrb
create_bd_port -dir O PLP_M_AXI_DATA_C2H_00_wvalid
create_bd_port -dir O -from 38 -to 0 PLP_M_AXI_DATA_U2S_00_araddr
create_bd_port -dir O -from 1 -to 0 PLP_M_AXI_DATA_U2S_00_arburst
create_bd_port -dir O -from 3 -to 0 PLP_M_AXI_DATA_U2S_00_arcache
create_bd_port -dir O -from 3 -to 0 PLP_M_AXI_DATA_U2S_00_arid
create_bd_port -dir O -from 7 -to 0 PLP_M_AXI_DATA_U2S_00_arlen
create_bd_port -dir O -from 0 -to 0 PLP_M_AXI_DATA_U2S_00_arlock
create_bd_port -dir O -from 2 -to 0 PLP_M_AXI_DATA_U2S_00_arprot
create_bd_port -dir I PLP_M_AXI_DATA_U2S_00_arready
create_bd_port -dir O PLP_M_AXI_DATA_U2S_00_arvalid
create_bd_port -dir O -from 38 -to 0 PLP_M_AXI_DATA_U2S_00_awaddr
create_bd_port -dir O -from 1 -to 0 PLP_M_AXI_DATA_U2S_00_awburst
create_bd_port -dir O -from 3 -to 0 PLP_M_AXI_DATA_U2S_00_awcache
create_bd_port -dir O -from 3 -to 0 PLP_M_AXI_DATA_U2S_00_awid
create_bd_port -dir O -from 7 -to 0 PLP_M_AXI_DATA_U2S_00_awlen
create_bd_port -dir O -from 0 -to 0 PLP_M_AXI_DATA_U2S_00_awlock
create_bd_port -dir O -from 2 -to 0 PLP_M_AXI_DATA_U2S_00_awprot
create_bd_port -dir I PLP_M_AXI_DATA_U2S_00_awready
create_bd_port -dir O PLP_M_AXI_DATA_U2S_00_awvalid
create_bd_port -dir I -from 3 -to 0 PLP_M_AXI_DATA_U2S_00_bid
create_bd_port -dir O PLP_M_AXI_DATA_U2S_00_bready
create_bd_port -dir I -from 1 -to 0 PLP_M_AXI_DATA_U2S_00_bresp
create_bd_port -dir I PLP_M_AXI_DATA_U2S_00_bvalid
create_bd_port -dir I -from 511 -to 0 PLP_M_AXI_DATA_U2S_00_rdata
create_bd_port -dir I -from 3 -to 0 PLP_M_AXI_DATA_U2S_00_rid
create_bd_port -dir I PLP_M_AXI_DATA_U2S_00_rlast
create_bd_port -dir O PLP_M_AXI_DATA_U2S_00_rready
create_bd_port -dir I -from 1 -to 0 PLP_M_AXI_DATA_U2S_00_rresp
create_bd_port -dir I PLP_M_AXI_DATA_U2S_00_rvalid
create_bd_port -dir O -from 511 -to 0 PLP_M_AXI_DATA_U2S_00_wdata
create_bd_port -dir O PLP_M_AXI_DATA_U2S_00_wlast
create_bd_port -dir I PLP_M_AXI_DATA_U2S_00_wready
create_bd_port -dir O -from 63 -to 0 PLP_M_AXI_DATA_U2S_00_wstrb
create_bd_port -dir O PLP_M_AXI_DATA_U2S_00_wvalid
create_bd_port -dir I -from 23 -to 0 PLP_S_AXI_CTRL_MGMT_00_araddr
create_bd_port -dir I -from 2 -to 0 PLP_S_AXI_CTRL_MGMT_00_arprot
create_bd_port -dir O PLP_S_AXI_CTRL_MGMT_00_arready
create_bd_port -dir I PLP_S_AXI_CTRL_MGMT_00_arvalid
create_bd_port -dir I -from 23 -to 0 PLP_S_AXI_CTRL_MGMT_00_awaddr
create_bd_port -dir I -from 2 -to 0 PLP_S_AXI_CTRL_MGMT_00_awprot
create_bd_port -dir O PLP_S_AXI_CTRL_MGMT_00_awready
create_bd_port -dir I PLP_S_AXI_CTRL_MGMT_00_awvalid
create_bd_port -dir I PLP_S_AXI_CTRL_MGMT_00_bready
create_bd_port -dir O -from 1 -to 0 PLP_S_AXI_CTRL_MGMT_00_bresp
create_bd_port -dir O PLP_S_AXI_CTRL_MGMT_00_bvalid
create_bd_port -dir O -from 31 -to 0 PLP_S_AXI_CTRL_MGMT_00_rdata
create_bd_port -dir I PLP_S_AXI_CTRL_MGMT_00_rready
create_bd_port -dir O -from 1 -to 0 PLP_S_AXI_CTRL_MGMT_00_rresp
create_bd_port -dir O PLP_S_AXI_CTRL_MGMT_00_rvalid
create_bd_port -dir I -from 31 -to 0 PLP_S_AXI_CTRL_MGMT_00_wdata
create_bd_port -dir O PLP_S_AXI_CTRL_MGMT_00_wready
create_bd_port -dir I -from 3 -to 0 PLP_S_AXI_CTRL_MGMT_00_wstrb
create_bd_port -dir I PLP_S_AXI_CTRL_MGMT_00_wvalid
create_bd_port -dir I -from 23 -to 0 PLP_S_AXI_CTRL_MGMT_01_araddr
create_bd_port -dir I -from 2 -to 0 PLP_S_AXI_CTRL_MGMT_01_arprot
create_bd_port -dir O PLP_S_AXI_CTRL_MGMT_01_arready
create_bd_port -dir I PLP_S_AXI_CTRL_MGMT_01_arvalid
create_bd_port -dir I -from 23 -to 0 PLP_S_AXI_CTRL_MGMT_01_awaddr
create_bd_port -dir I -from 2 -to 0 PLP_S_AXI_CTRL_MGMT_01_awprot
create_bd_port -dir O PLP_S_AXI_CTRL_MGMT_01_awready
create_bd_port -dir I PLP_S_AXI_CTRL_MGMT_01_awvalid
create_bd_port -dir I PLP_S_AXI_CTRL_MGMT_01_bready
create_bd_port -dir O -from 1 -to 0 PLP_S_AXI_CTRL_MGMT_01_bresp
create_bd_port -dir O PLP_S_AXI_CTRL_MGMT_01_bvalid
create_bd_port -dir O -from 31 -to 0 PLP_S_AXI_CTRL_MGMT_01_rdata
create_bd_port -dir I PLP_S_AXI_CTRL_MGMT_01_rready
create_bd_port -dir O -from 1 -to 0 PLP_S_AXI_CTRL_MGMT_01_rresp
create_bd_port -dir O PLP_S_AXI_CTRL_MGMT_01_rvalid
create_bd_port -dir I -from 31 -to 0 PLP_S_AXI_CTRL_MGMT_01_wdata
create_bd_port -dir O PLP_S_AXI_CTRL_MGMT_01_wready
create_bd_port -dir I -from 3 -to 0 PLP_S_AXI_CTRL_MGMT_01_wstrb
create_bd_port -dir I PLP_S_AXI_CTRL_MGMT_01_wvalid
create_bd_port -dir I -from 24 -to 0 PLP_S_AXI_CTRL_USER_00_araddr
create_bd_port -dir I -from 2 -to 0 PLP_S_AXI_CTRL_USER_00_arprot
create_bd_port -dir O PLP_S_AXI_CTRL_USER_00_arready
create_bd_port -dir I PLP_S_AXI_CTRL_USER_00_arvalid
create_bd_port -dir I -from 24 -to 0 PLP_S_AXI_CTRL_USER_00_awaddr
create_bd_port -dir I -from 2 -to 0 PLP_S_AXI_CTRL_USER_00_awprot
create_bd_port -dir O PLP_S_AXI_CTRL_USER_00_awready
create_bd_port -dir I PLP_S_AXI_CTRL_USER_00_awvalid
create_bd_port -dir I PLP_S_AXI_CTRL_USER_00_bready
create_bd_port -dir O -from 1 -to 0 PLP_S_AXI_CTRL_USER_00_bresp
create_bd_port -dir O PLP_S_AXI_CTRL_USER_00_bvalid
create_bd_port -dir O -from 31 -to 0 PLP_S_AXI_CTRL_USER_00_rdata
create_bd_port -dir I PLP_S_AXI_CTRL_USER_00_rready
create_bd_port -dir O -from 1 -to 0 PLP_S_AXI_CTRL_USER_00_rresp
create_bd_port -dir O PLP_S_AXI_CTRL_USER_00_rvalid
create_bd_port -dir I -from 31 -to 0 PLP_S_AXI_CTRL_USER_00_wdata
create_bd_port -dir O PLP_S_AXI_CTRL_USER_00_wready
create_bd_port -dir I -from 3 -to 0 PLP_S_AXI_CTRL_USER_00_wstrb
create_bd_port -dir I PLP_S_AXI_CTRL_USER_00_wvalid
create_bd_port -dir I -from 24 -to 0 PLP_S_AXI_CTRL_USER_01_araddr
create_bd_port -dir I -from 2 -to 0 PLP_S_AXI_CTRL_USER_01_arprot
create_bd_port -dir O PLP_S_AXI_CTRL_USER_01_arready
create_bd_port -dir I PLP_S_AXI_CTRL_USER_01_arvalid
create_bd_port -dir I -from 24 -to 0 PLP_S_AXI_CTRL_USER_01_awaddr
create_bd_port -dir I -from 2 -to 0 PLP_S_AXI_CTRL_USER_01_awprot
create_bd_port -dir O PLP_S_AXI_CTRL_USER_01_awready
create_bd_port -dir I PLP_S_AXI_CTRL_USER_01_awvalid
create_bd_port -dir I PLP_S_AXI_CTRL_USER_01_bready
create_bd_port -dir O -from 1 -to 0 PLP_S_AXI_CTRL_USER_01_bresp
create_bd_port -dir O PLP_S_AXI_CTRL_USER_01_bvalid
create_bd_port -dir O -from 31 -to 0 PLP_S_AXI_CTRL_USER_01_rdata
create_bd_port -dir I PLP_S_AXI_CTRL_USER_01_rready
create_bd_port -dir O -from 1 -to 0 PLP_S_AXI_CTRL_USER_01_rresp
create_bd_port -dir O PLP_S_AXI_CTRL_USER_01_rvalid
create_bd_port -dir I -from 31 -to 0 PLP_S_AXI_CTRL_USER_01_wdata
create_bd_port -dir O PLP_S_AXI_CTRL_USER_01_wready
create_bd_port -dir I -from 3 -to 0 PLP_S_AXI_CTRL_USER_01_wstrb
create_bd_port -dir I PLP_S_AXI_CTRL_USER_01_wvalid
create_bd_port -dir I -from 24 -to 0 PLP_S_AXI_CTRL_USER_02_araddr
create_bd_port -dir I -from 2 -to 0 PLP_S_AXI_CTRL_USER_02_arprot
create_bd_port -dir O PLP_S_AXI_CTRL_USER_02_arready
create_bd_port -dir I PLP_S_AXI_CTRL_USER_02_arvalid
create_bd_port -dir I -from 24 -to 0 PLP_S_AXI_CTRL_USER_02_awaddr
create_bd_port -dir I -from 2 -to 0 PLP_S_AXI_CTRL_USER_02_awprot
create_bd_port -dir O PLP_S_AXI_CTRL_USER_02_awready
create_bd_port -dir I PLP_S_AXI_CTRL_USER_02_awvalid
create_bd_port -dir I PLP_S_AXI_CTRL_USER_02_bready
create_bd_port -dir O -from 1 -to 0 PLP_S_AXI_CTRL_USER_02_bresp
create_bd_port -dir O PLP_S_AXI_CTRL_USER_02_bvalid
create_bd_port -dir O -from 31 -to 0 PLP_S_AXI_CTRL_USER_02_rdata
create_bd_port -dir I PLP_S_AXI_CTRL_USER_02_rready
create_bd_port -dir O -from 1 -to 0 PLP_S_AXI_CTRL_USER_02_rresp
create_bd_port -dir O PLP_S_AXI_CTRL_USER_02_rvalid
create_bd_port -dir I -from 31 -to 0 PLP_S_AXI_CTRL_USER_02_wdata
create_bd_port -dir O PLP_S_AXI_CTRL_USER_02_wready
create_bd_port -dir I -from 3 -to 0 PLP_S_AXI_CTRL_USER_02_wstrb
create_bd_port -dir I PLP_S_AXI_CTRL_USER_02_wvalid
create_bd_port -dir I -from 24 -to 0 PLP_S_AXI_CTRL_USER_03_araddr
create_bd_port -dir I -from 2 -to 0 PLP_S_AXI_CTRL_USER_03_arprot
create_bd_port -dir O PLP_S_AXI_CTRL_USER_03_arready
create_bd_port -dir I PLP_S_AXI_CTRL_USER_03_arvalid
create_bd_port -dir I -from 24 -to 0 PLP_S_AXI_CTRL_USER_03_awaddr
create_bd_port -dir I -from 2 -to 0 PLP_S_AXI_CTRL_USER_03_awprot
create_bd_port -dir O PLP_S_AXI_CTRL_USER_03_awready
create_bd_port -dir I PLP_S_AXI_CTRL_USER_03_awvalid
create_bd_port -dir I PLP_S_AXI_CTRL_USER_03_bready
create_bd_port -dir O -from 1 -to 0 PLP_S_AXI_CTRL_USER_03_bresp
create_bd_port -dir O PLP_S_AXI_CTRL_USER_03_bvalid
create_bd_port -dir O -from 31 -to 0 PLP_S_AXI_CTRL_USER_03_rdata
create_bd_port -dir I PLP_S_AXI_CTRL_USER_03_rready
create_bd_port -dir O -from 1 -to 0 PLP_S_AXI_CTRL_USER_03_rresp
create_bd_port -dir O PLP_S_AXI_CTRL_USER_03_rvalid
create_bd_port -dir I -from 31 -to 0 PLP_S_AXI_CTRL_USER_03_wdata
create_bd_port -dir O PLP_S_AXI_CTRL_USER_03_wready
create_bd_port -dir I -from 3 -to 0 PLP_S_AXI_CTRL_USER_03_wstrb
create_bd_port -dir I PLP_S_AXI_CTRL_USER_03_wvalid
create_bd_port -dir I -from 24 -to 0 PLP_S_AXI_CTRL_USER_DEBUG_00_araddr
create_bd_port -dir I -from 2 -to 0 PLP_S_AXI_CTRL_USER_DEBUG_00_arprot
create_bd_port -dir O PLP_S_AXI_CTRL_USER_DEBUG_00_arready
create_bd_port -dir I PLP_S_AXI_CTRL_USER_DEBUG_00_arvalid
create_bd_port -dir I -from 24 -to 0 PLP_S_AXI_CTRL_USER_DEBUG_00_awaddr
create_bd_port -dir I -from 2 -to 0 PLP_S_AXI_CTRL_USER_DEBUG_00_awprot
create_bd_port -dir O PLP_S_AXI_CTRL_USER_DEBUG_00_awready
create_bd_port -dir I PLP_S_AXI_CTRL_USER_DEBUG_00_awvalid
create_bd_port -dir I PLP_S_AXI_CTRL_USER_DEBUG_00_bready
create_bd_port -dir O -from 1 -to 0 PLP_S_AXI_CTRL_USER_DEBUG_00_bresp
create_bd_port -dir O PLP_S_AXI_CTRL_USER_DEBUG_00_bvalid
create_bd_port -dir O -from 31 -to 0 PLP_S_AXI_CTRL_USER_DEBUG_00_rdata
create_bd_port -dir I PLP_S_AXI_CTRL_USER_DEBUG_00_rready
create_bd_port -dir O -from 1 -to 0 PLP_S_AXI_CTRL_USER_DEBUG_00_rresp
create_bd_port -dir O PLP_S_AXI_CTRL_USER_DEBUG_00_rvalid
create_bd_port -dir I -from 31 -to 0 PLP_S_AXI_CTRL_USER_DEBUG_00_wdata
create_bd_port -dir O PLP_S_AXI_CTRL_USER_DEBUG_00_wready
create_bd_port -dir I -from 3 -to 0 PLP_S_AXI_CTRL_USER_DEBUG_00_wstrb
create_bd_port -dir I PLP_S_AXI_CTRL_USER_DEBUG_00_wvalid
create_bd_port -dir I -from 38 -to 0 PLP_S_AXI_DATA_H2C_00_araddr
create_bd_port -dir I -from 1 -to 0 PLP_S_AXI_DATA_H2C_00_arburst
create_bd_port -dir I -from 3 -to 0 PLP_S_AXI_DATA_H2C_00_arcache
create_bd_port -dir I -from 7 -to 0 PLP_S_AXI_DATA_H2C_00_arlen
create_bd_port -dir I -from 0 -to 0 PLP_S_AXI_DATA_H2C_00_arlock
create_bd_port -dir I -from 2 -to 0 PLP_S_AXI_DATA_H2C_00_arprot
create_bd_port -dir O PLP_S_AXI_DATA_H2C_00_arready
create_bd_port -dir I PLP_S_AXI_DATA_H2C_00_arvalid
create_bd_port -dir I -from 38 -to 0 PLP_S_AXI_DATA_H2C_00_awaddr
create_bd_port -dir I -from 1 -to 0 PLP_S_AXI_DATA_H2C_00_awburst
create_bd_port -dir I -from 3 -to 0 PLP_S_AXI_DATA_H2C_00_awcache
create_bd_port -dir I -from 7 -to 0 PLP_S_AXI_DATA_H2C_00_awlen
create_bd_port -dir I -from 0 -to 0 PLP_S_AXI_DATA_H2C_00_awlock
create_bd_port -dir I -from 2 -to 0 PLP_S_AXI_DATA_H2C_00_awprot
create_bd_port -dir O PLP_S_AXI_DATA_H2C_00_awready
create_bd_port -dir I PLP_S_AXI_DATA_H2C_00_awvalid
create_bd_port -dir I PLP_S_AXI_DATA_H2C_00_bready
create_bd_port -dir O -from 1 -to 0 PLP_S_AXI_DATA_H2C_00_bresp
create_bd_port -dir O PLP_S_AXI_DATA_H2C_00_bvalid
create_bd_port -dir O -from 511 -to 0 PLP_S_AXI_DATA_H2C_00_rdata
create_bd_port -dir O PLP_S_AXI_DATA_H2C_00_rlast
create_bd_port -dir I PLP_S_AXI_DATA_H2C_00_rready
create_bd_port -dir O -from 1 -to 0 PLP_S_AXI_DATA_H2C_00_rresp
create_bd_port -dir O PLP_S_AXI_DATA_H2C_00_rvalid
create_bd_port -dir I -from 511 -to 0 PLP_S_AXI_DATA_H2C_00_wdata
create_bd_port -dir I PLP_S_AXI_DATA_H2C_00_wlast
create_bd_port -dir O PLP_S_AXI_DATA_H2C_00_wready
create_bd_port -dir I -from 63 -to 0 PLP_S_AXI_DATA_H2C_00_wstrb
create_bd_port -dir I PLP_S_AXI_DATA_H2C_00_wvalid
create_bd_port -dir I -from 3 -to 0 PLP_S_AXI_DATA_H2C_00_arid
create_bd_port -dir I -from 3 -to 0 PLP_S_AXI_DATA_H2C_00_awid
create_bd_port -dir O -from 3 -to 0 PLP_S_AXI_DATA_H2C_00_bid
create_bd_port -dir O -from 3 -to 0 PLP_S_AXI_DATA_H2C_00_rid
create_bd_port -dir I -from 38 -to 0 PLP_S_AXI_DATA_H2C_01_araddr
create_bd_port -dir I -from 1 -to 0 PLP_S_AXI_DATA_H2C_01_arburst
create_bd_port -dir I -from 3 -to 0 PLP_S_AXI_DATA_H2C_01_arcache
create_bd_port -dir I -from 7 -to 0 PLP_S_AXI_DATA_H2C_01_arlen
create_bd_port -dir I -from 0 -to 0 PLP_S_AXI_DATA_H2C_01_arlock
create_bd_port -dir I -from 2 -to 0 PLP_S_AXI_DATA_H2C_01_arprot
create_bd_port -dir O PLP_S_AXI_DATA_H2C_01_arready
create_bd_port -dir I PLP_S_AXI_DATA_H2C_01_arvalid
create_bd_port -dir I -from 38 -to 0 PLP_S_AXI_DATA_H2C_01_awaddr
create_bd_port -dir I -from 1 -to 0 PLP_S_AXI_DATA_H2C_01_awburst
create_bd_port -dir I -from 3 -to 0 PLP_S_AXI_DATA_H2C_01_awcache
create_bd_port -dir I -from 7 -to 0 PLP_S_AXI_DATA_H2C_01_awlen
create_bd_port -dir I -from 0 -to 0 PLP_S_AXI_DATA_H2C_01_awlock
create_bd_port -dir I -from 2 -to 0 PLP_S_AXI_DATA_H2C_01_awprot
create_bd_port -dir O PLP_S_AXI_DATA_H2C_01_awready
create_bd_port -dir I PLP_S_AXI_DATA_H2C_01_awvalid
create_bd_port -dir I PLP_S_AXI_DATA_H2C_01_bready
create_bd_port -dir O -from 1 -to 0 PLP_S_AXI_DATA_H2C_01_bresp
create_bd_port -dir O PLP_S_AXI_DATA_H2C_01_bvalid
create_bd_port -dir O -from 511 -to 0 PLP_S_AXI_DATA_H2C_01_rdata
create_bd_port -dir O PLP_S_AXI_DATA_H2C_01_rlast
create_bd_port -dir I PLP_S_AXI_DATA_H2C_01_rready
create_bd_port -dir O -from 1 -to 0 PLP_S_AXI_DATA_H2C_01_rresp
create_bd_port -dir O PLP_S_AXI_DATA_H2C_01_rvalid
create_bd_port -dir I -from 511 -to 0 PLP_S_AXI_DATA_H2C_01_wdata
create_bd_port -dir I PLP_S_AXI_DATA_H2C_01_wlast
create_bd_port -dir O PLP_S_AXI_DATA_H2C_01_wready
create_bd_port -dir I -from 63 -to 0 PLP_S_AXI_DATA_H2C_01_wstrb
create_bd_port -dir I PLP_S_AXI_DATA_H2C_01_wvalid
create_bd_port -dir I -from 3 -to 0 PLP_S_AXI_DATA_H2C_01_arid
create_bd_port -dir I -from 3 -to 0 PLP_S_AXI_DATA_H2C_01_awid
create_bd_port -dir O -from 3 -to 0 PLP_S_AXI_DATA_H2C_01_bid
create_bd_port -dir O -from 3 -to 0 PLP_S_AXI_DATA_H2C_01_rid
create_bd_port -dir I -from 38 -to 0 PLP_S_AXI_DATA_H2C_02_araddr
create_bd_port -dir I -from 1 -to 0 PLP_S_AXI_DATA_H2C_02_arburst
create_bd_port -dir I -from 3 -to 0 PLP_S_AXI_DATA_H2C_02_arcache
create_bd_port -dir I -from 7 -to 0 PLP_S_AXI_DATA_H2C_02_arlen
create_bd_port -dir I -from 0 -to 0 PLP_S_AXI_DATA_H2C_02_arlock
create_bd_port -dir I -from 2 -to 0 PLP_S_AXI_DATA_H2C_02_arprot
create_bd_port -dir O PLP_S_AXI_DATA_H2C_02_arready
create_bd_port -dir I PLP_S_AXI_DATA_H2C_02_arvalid
create_bd_port -dir I -from 38 -to 0 PLP_S_AXI_DATA_H2C_02_awaddr
create_bd_port -dir I -from 1 -to 0 PLP_S_AXI_DATA_H2C_02_awburst
create_bd_port -dir I -from 3 -to 0 PLP_S_AXI_DATA_H2C_02_awcache
create_bd_port -dir I -from 7 -to 0 PLP_S_AXI_DATA_H2C_02_awlen
create_bd_port -dir I -from 0 -to 0 PLP_S_AXI_DATA_H2C_02_awlock
create_bd_port -dir I -from 2 -to 0 PLP_S_AXI_DATA_H2C_02_awprot
create_bd_port -dir O PLP_S_AXI_DATA_H2C_02_awready
create_bd_port -dir I PLP_S_AXI_DATA_H2C_02_awvalid
create_bd_port -dir I PLP_S_AXI_DATA_H2C_02_bready
create_bd_port -dir O -from 1 -to 0 PLP_S_AXI_DATA_H2C_02_bresp
create_bd_port -dir O PLP_S_AXI_DATA_H2C_02_bvalid
create_bd_port -dir O -from 511 -to 0 PLP_S_AXI_DATA_H2C_02_rdata
create_bd_port -dir O PLP_S_AXI_DATA_H2C_02_rlast
create_bd_port -dir I PLP_S_AXI_DATA_H2C_02_rready
create_bd_port -dir O -from 1 -to 0 PLP_S_AXI_DATA_H2C_02_rresp
create_bd_port -dir O PLP_S_AXI_DATA_H2C_02_rvalid
create_bd_port -dir I -from 511 -to 0 PLP_S_AXI_DATA_H2C_02_wdata
create_bd_port -dir I PLP_S_AXI_DATA_H2C_02_wlast
create_bd_port -dir O PLP_S_AXI_DATA_H2C_02_wready
create_bd_port -dir I -from 63 -to 0 PLP_S_AXI_DATA_H2C_02_wstrb
create_bd_port -dir I PLP_S_AXI_DATA_H2C_02_wvalid
create_bd_port -dir I -from 3 -to 0 PLP_S_AXI_DATA_H2C_02_arid
create_bd_port -dir I -from 3 -to 0 PLP_S_AXI_DATA_H2C_02_awid
create_bd_port -dir O -from 3 -to 0 PLP_S_AXI_DATA_H2C_02_bid
create_bd_port -dir O -from 3 -to 0 PLP_S_AXI_DATA_H2C_02_rid
create_bd_port -dir I -from 38 -to 0 PLP_S_AXI_DATA_H2C_03_araddr
create_bd_port -dir I -from 1 -to 0 PLP_S_AXI_DATA_H2C_03_arburst
create_bd_port -dir I -from 3 -to 0 PLP_S_AXI_DATA_H2C_03_arcache
create_bd_port -dir I -from 7 -to 0 PLP_S_AXI_DATA_H2C_03_arlen
create_bd_port -dir I -from 0 -to 0 PLP_S_AXI_DATA_H2C_03_arlock
create_bd_port -dir I -from 2 -to 0 PLP_S_AXI_DATA_H2C_03_arprot
create_bd_port -dir O PLP_S_AXI_DATA_H2C_03_arready
create_bd_port -dir I PLP_S_AXI_DATA_H2C_03_arvalid
create_bd_port -dir I -from 38 -to 0 PLP_S_AXI_DATA_H2C_03_awaddr
create_bd_port -dir I -from 1 -to 0 PLP_S_AXI_DATA_H2C_03_awburst
create_bd_port -dir I -from 3 -to 0 PLP_S_AXI_DATA_H2C_03_awcache
create_bd_port -dir I -from 7 -to 0 PLP_S_AXI_DATA_H2C_03_awlen
create_bd_port -dir I -from 0 -to 0 PLP_S_AXI_DATA_H2C_03_awlock
create_bd_port -dir I -from 2 -to 0 PLP_S_AXI_DATA_H2C_03_awprot
create_bd_port -dir O PLP_S_AXI_DATA_H2C_03_awready
create_bd_port -dir I PLP_S_AXI_DATA_H2C_03_awvalid
create_bd_port -dir I PLP_S_AXI_DATA_H2C_03_bready
create_bd_port -dir O -from 1 -to 0 PLP_S_AXI_DATA_H2C_03_bresp
create_bd_port -dir O PLP_S_AXI_DATA_H2C_03_bvalid
create_bd_port -dir O -from 511 -to 0 PLP_S_AXI_DATA_H2C_03_rdata
create_bd_port -dir O PLP_S_AXI_DATA_H2C_03_rlast
create_bd_port -dir I PLP_S_AXI_DATA_H2C_03_rready
create_bd_port -dir O -from 1 -to 0 PLP_S_AXI_DATA_H2C_03_rresp
create_bd_port -dir O PLP_S_AXI_DATA_H2C_03_rvalid
create_bd_port -dir I -from 511 -to 0 PLP_S_AXI_DATA_H2C_03_wdata
create_bd_port -dir I PLP_S_AXI_DATA_H2C_03_wlast
create_bd_port -dir O PLP_S_AXI_DATA_H2C_03_wready
create_bd_port -dir I -from 63 -to 0 PLP_S_AXI_DATA_H2C_03_wstrb
create_bd_port -dir I PLP_S_AXI_DATA_H2C_03_wvalid
create_bd_port -dir I -from 3 -to 0 PLP_S_AXI_DATA_H2C_03_arid
create_bd_port -dir I -from 3 -to 0 PLP_S_AXI_DATA_H2C_03_awid
create_bd_port -dir O -from 3 -to 0 PLP_S_AXI_DATA_H2C_03_bid
create_bd_port -dir O -from 3 -to 0 PLP_S_AXI_DATA_H2C_03_rid
create_bd_port -dir O -from 0 -to 0 -type data plp_m_data_ddr4_calib_complete_00
create_bd_port -dir O -from 127 -to 0 -type intr plp_m_irq_kernel_00
create_bd_port -dir I -type clk plp_s_aclk_ctrl_00
set_property -dict [list \
  CONFIG.ASSOCIATED_BUSIF PLP_S_AXI_CTRL_MGMT_00:PLP_S_AXI_CTRL_MGMT_01:PLP_S_AXI_CTRL_USER_DEBUG_00:PLP_M_DATA_DDR4_CALIB_COMPLETE_00:PLP_S_DATA_SATELLITE_CTRL_DATA_00:PLP_M_IRQ_KERNEL_00 \
  CONFIG.ASSOCIATED_RESET plp_s_aresetn_ctrl_00 \
  CONFIG.CLK_DOMAIN cd_ctrl_00 \
  CONFIG.FREQ_HZ 50000000 \
  CONFIG.FREQ_TOLERANCE_HZ 0 \
  CONFIG.INSERT_VIP 0 \
  CONFIG.PHASE 0 \
] [get_bd_ports plp_s_aclk_ctrl_00]
create_bd_port -dir I -type clk plp_s_aclk_data_u2s_00
set_property -dict [list \
  CONFIG.ASSOCIATED_BUSIF PLP_M_AXI_DATA_U2S_00 \
  CONFIG.ASSOCIATED_RESET plp_s_aresetn_data_u2s_00 \
  CONFIG.CLK_DOMAIN cd_data_u2s_00 \
  CONFIG.FREQ_HZ 300000000 \
  CONFIG.FREQ_TOLERANCE_HZ 0 \
  CONFIG.INSERT_VIP 0 \
  CONFIG.PHASE 0 \
] [get_bd_ports plp_s_aclk_data_u2s_00]
create_bd_port -dir I -type clk plp_s_aclk_freerun_ref_00
set_property -dict [list \
  CONFIG.CLK_DOMAIN cd_freerun_ref_00 \
  CONFIG.FREQ_HZ 100000000 \
  CONFIG.FREQ_TOLERANCE_HZ 0 \
  CONFIG.INSERT_VIP 0 \
  CONFIG.PHASE 0 \
] [get_bd_ports plp_s_aclk_freerun_ref_00]
create_bd_port -dir I -type clk plp_s_aclk_pcie_user_00
set_property -dict [list \
  CONFIG.ASSOCIATED_BUSIF PLP_S_AXI_CTRL_USER_00:PLP_S_AXI_CTRL_USER_01:PLP_S_AXI_CTRL_USER_02:PLP_S_AXI_CTRL_USER_03:PLP_M_AXI_DATA_C2H_00:PLP_S_AXI_DATA_H2C_00:PLP_S_AXI_DATA_H2C_01:PLP_S_AXI_DATA_H2C_02:PLP_S_AXI_DATA_H2C_03 \
  CONFIG.ASSOCIATED_RESET plp_s_aresetn_pcie_user_00 \
  CONFIG.CLK_DOMAIN cd_pcie_user_00 \
  CONFIG.FREQ_HZ 250000000 \
  CONFIG.FREQ_TOLERANCE_HZ 0 \
  CONFIG.INSERT_VIP 0 \
  CONFIG.PHASE 0 \
] [get_bd_ports plp_s_aclk_pcie_user_00]
create_bd_port -dir I -from 0 -to 0 -type rst plp_s_aresetn_ctrl_00
set_property -dict {CONFIG.INSERT_VIP 0 CONFIG.POLARITY ACTIVE_LOW} [get_bd_ports plp_s_aresetn_ctrl_00]
create_bd_port -dir I -from 0 -to 0 -type rst plp_s_aresetn_data_u2s_00
set_property -dict {CONFIG.INSERT_VIP 0 CONFIG.POLARITY ACTIVE_LOW} [get_bd_ports plp_s_aresetn_data_u2s_00]
create_bd_port -dir I -from 0 -to 0 -type rst plp_s_aresetn_pcie_user_00
set_property -dict {CONFIG.INSERT_VIP 0 CONFIG.POLARITY ACTIVE_LOW} [get_bd_ports plp_s_aresetn_pcie_user_00]
create_bd_port -dir I -from 3 -to 0 -type data plp_s_data_satellite_ctrl_data_00
set_property -dict {CONFIG.LAYERED_METADATA undef} [get_bd_ports plp_s_data_satellite_ctrl_data_00]

create_bd_cell -type ip -vlnv xilinx.com:ip:ii_level1_wire:1.0 ii_level1_wire
create_bd_cell -type ip -vlnv xilinx.com:ip:sdx_memory_subsystem:1.0 memory_subsystem
set_property -dict [list \
  CONFIG.ADVANCED_PROPERTIES {['resource_access_constraints {S00_AXI {DDR4_MEM00 PLRAM_MEM00}         S01_AXI {M00_AXI_MEM00 M01_AXI_MEM00 PLRAM_MEM01}         S02_AXI {DDR4_MEM01 PLRAM_MEM02}         S03_AXI {DDR4_MEM02 PLRAM_MEM03}}', 'resource_map_replication {S00_AXI {} S01_AXI {} S02_AXI {} S03_AXI {}}', 'plram_specifications {', '{ SIZE 128K AXI_DATA_WIDTH 512 SLR_ASSIGNMENT SLR0 }                                       { SIZE 128K AXI_DATA_WIDTH 512 SLR_ASSIGNMENT SLR1 }                                       { SIZE 128K', 'AXI_DATA_WIDTH 512 SLR_ASSIGNMENT SLR2 }                                       { SIZE 128K AXI_DATA_WIDTH 512 SLR_ASSIGNMENT SLR3 }', '}', '__temp_dsa_info {', 'excluded_board_components {xilinx.com:au250:ddr4_sdram_c1:1.4}       axi_passthrough {           M00_AXI_AXI {            offset 0x5000000000           range 16G           slr SLR1          }        ', 'M01_AXI {            offset 0x2000000000             range 16G           slr SLR2          }       }', '}']} \
  CONFIG.NUM_CLKS 4 \
  CONFIG.NUM_SI 7 \
] [get_bd_cells memory_subsystem]
create_bd_cell -type ip -vlnv xilinx.com:ip:shell_ucs_subsystem:3.0 ss_ucs
set_property -dict [list \
  CONFIG.MGMT_PF_BASE_ADDRESS 0x00980000 \
  CONFIG.NUM_RESET_FANOUT_FLOPS_SLR3 6 \
  CONFIG.NUM_SLR 4 \
] [get_bd_cells ss_ucs]
create_bd_cell -type ip -vlnv xilinx.com:ip:axi_clock_converter:2.1 ip_cc_axi_data_h2c_00
set_property -dict {CONFIG.SLR_ASSIGNMENTS SLR0} [get_bd_cells ip_cc_axi_data_h2c_00]
create_bd_cell -type ip -vlnv xilinx.com:ip:axi_clock_converter:2.1 ip_cc_axi_data_h2c_01
set_property -dict {CONFIG.SLR_ASSIGNMENTS SLR1} [get_bd_cells ip_cc_axi_data_h2c_01]
create_bd_cell -type ip -vlnv xilinx.com:ip:axi_clock_converter:2.1 ip_cc_axi_data_h2c_02
set_property -dict {CONFIG.SLR_ASSIGNMENTS SLR2} [get_bd_cells ip_cc_axi_data_h2c_02]
create_bd_cell -type ip -vlnv xilinx.com:ip:axi_clock_converter:2.1 ip_cc_axi_data_h2c_03
set_property -dict {CONFIG.SLR_ASSIGNMENTS SLR3} [get_bd_cells ip_cc_axi_data_h2c_03]
create_bd_cell -type ip -vlnv xilinx.com:ip:axi_register_slice:2.1 ip_rs_axi_data_h2c_03
set_property -dict [list \
  CONFIG.NUM_SLR_CROSSINGS 1 \
  CONFIG.PIPELINES_MASTER_AR 0 \
  CONFIG.PIPELINES_MASTER_AW 0 \
  CONFIG.PIPELINES_MASTER_B 0 \
  CONFIG.PIPELINES_MASTER_R 0 \
  CONFIG.PIPELINES_MASTER_W 0 \
  CONFIG.PIPELINES_SLAVE_AR 0 \
  CONFIG.PIPELINES_SLAVE_AW 0 \
  CONFIG.PIPELINES_SLAVE_B 0 \
  CONFIG.PIPELINES_SLAVE_R 0 \
  CONFIG.PIPELINES_SLAVE_W 0 \
  CONFIG.REG_AR 15 \
  CONFIG.REG_AW 15 \
  CONFIG.REG_B 15 \
  CONFIG.REG_R 15 \
  CONFIG.REG_W 15 \
  CONFIG.USE_AUTOPIPELINING 0 \
] [get_bd_cells ip_rs_axi_data_h2c_03]
create_bd_cell -type ip -vlnv xilinx.com:ip:axi_register_slice:2.1 ip_rs_axi_ctrl_user_03
set_property -dict [list \
  CONFIG.NUM_SLR_CROSSINGS 1 \
  CONFIG.PIPELINES_MASTER_AR 0 \
  CONFIG.PIPELINES_MASTER_AW 0 \
  CONFIG.PIPELINES_MASTER_B 0 \
  CONFIG.PIPELINES_MASTER_R 0 \
  CONFIG.PIPELINES_MASTER_W 0 \
  CONFIG.PIPELINES_SLAVE_AR 0 \
  CONFIG.PIPELINES_SLAVE_AW 0 \
  CONFIG.PIPELINES_SLAVE_B 0 \
  CONFIG.PIPELINES_SLAVE_R 0 \
  CONFIG.PIPELINES_SLAVE_W 0 \
  CONFIG.REG_AR 15 \
  CONFIG.REG_AW 15 \
  CONFIG.REG_B 15 \
  CONFIG.REG_R 15 \
  CONFIG.REG_W 15 \
  CONFIG.USE_AUTOPIPELINING 0 \
] [get_bd_cells ip_rs_axi_ctrl_user_03]
create_bd_cell -type ip -vlnv xilinx.com:ip:axi_register_slice:2.1 ip_rs_axi_data_c2h_00
set_property -dict [list \
  CONFIG.NUM_SLR_CROSSINGS 0 \
  CONFIG.PIPELINES_MASTER_AR 0 \
  CONFIG.PIPELINES_MASTER_AW 0 \
  CONFIG.PIPELINES_MASTER_B 0 \
  CONFIG.PIPELINES_MASTER_R 0 \
  CONFIG.PIPELINES_MASTER_W 0 \
  CONFIG.REG_AR 15 \
  CONFIG.REG_AW 15 \
  CONFIG.REG_B 15 \
  CONFIG.REG_R 15 \
  CONFIG.REG_W 15 \
  CONFIG.USE_AUTOPIPELINING 0 \
] [get_bd_cells ip_rs_axi_data_c2h_00]
create_bd_cell -type ip -vlnv xilinx.com:ip:axi_interconnect:2.1 ict_axi_ctrl_mgmt_00
set_property -dict [list \
  CONFIG.M00_HAS_REGSLICE 4 \
  CONFIG.M01_HAS_REGSLICE 4 \
  CONFIG.M02_HAS_REGSLICE 4 \
  CONFIG.M03_HAS_REGSLICE 4 \
  CONFIG.M04_HAS_REGSLICE 4 \
  CONFIG.M05_HAS_REGSLICE 4 \
  CONFIG.M06_HAS_REGSLICE 4 \
  CONFIG.M07_HAS_REGSLICE 4 \
  CONFIG.M08_HAS_REGSLICE 4 \
  CONFIG.M09_HAS_REGSLICE 4 \
  CONFIG.M10_HAS_REGSLICE 4 \
  CONFIG.M11_HAS_REGSLICE 4 \
  CONFIG.M12_HAS_REGSLICE 4 \
  CONFIG.M13_HAS_REGSLICE 4 \
  CONFIG.M14_HAS_REGSLICE 4 \
  CONFIG.M15_HAS_REGSLICE 4 \
  CONFIG.M16_HAS_REGSLICE 4 \
  CONFIG.M17_HAS_REGSLICE 4 \
  CONFIG.M18_HAS_REGSLICE 4 \
  CONFIG.M19_HAS_REGSLICE 4 \
  CONFIG.M20_HAS_REGSLICE 4 \
  CONFIG.M21_HAS_REGSLICE 4 \
  CONFIG.M22_HAS_REGSLICE 4 \
  CONFIG.M23_HAS_REGSLICE 4 \
  CONFIG.M24_HAS_REGSLICE 4 \
  CONFIG.M25_HAS_REGSLICE 4 \
  CONFIG.M26_HAS_REGSLICE 4 \
  CONFIG.M27_HAS_REGSLICE 4 \
  CONFIG.M28_HAS_REGSLICE 4 \
  CONFIG.M29_HAS_REGSLICE 4 \
  CONFIG.M30_HAS_REGSLICE 4 \
  CONFIG.M31_HAS_REGSLICE 4 \
  CONFIG.M32_HAS_REGSLICE 4 \
  CONFIG.M33_HAS_REGSLICE 4 \
  CONFIG.M34_HAS_REGSLICE 4 \
  CONFIG.M35_HAS_REGSLICE 4 \
  CONFIG.M36_HAS_REGSLICE 4 \
  CONFIG.M37_HAS_REGSLICE 4 \
  CONFIG.M38_HAS_REGSLICE 4 \
  CONFIG.M39_HAS_REGSLICE 4 \
  CONFIG.M40_HAS_REGSLICE 4 \
  CONFIG.M41_HAS_REGSLICE 4 \
  CONFIG.M42_HAS_REGSLICE 4 \
  CONFIG.M43_HAS_REGSLICE 4 \
  CONFIG.M44_HAS_REGSLICE 4 \
  CONFIG.M45_HAS_REGSLICE 4 \
  CONFIG.M46_HAS_REGSLICE 4 \
  CONFIG.M47_HAS_REGSLICE 4 \
  CONFIG.M48_HAS_REGSLICE 4 \
  CONFIG.M49_HAS_REGSLICE 4 \
  CONFIG.M50_HAS_REGSLICE 4 \
  CONFIG.M51_HAS_REGSLICE 4 \
  CONFIG.M52_HAS_REGSLICE 4 \
  CONFIG.M53_HAS_REGSLICE 4 \
  CONFIG.M54_HAS_REGSLICE 4 \
  CONFIG.M55_HAS_REGSLICE 4 \
  CONFIG.M56_HAS_REGSLICE 4 \
  CONFIG.M57_HAS_REGSLICE 4 \
  CONFIG.M58_HAS_REGSLICE 4 \
  CONFIG.M59_HAS_REGSLICE 4 \
  CONFIG.M60_HAS_REGSLICE 4 \
  CONFIG.M61_HAS_REGSLICE 4 \
  CONFIG.M62_HAS_REGSLICE 4 \
  CONFIG.M63_HAS_REGSLICE 4 \
  CONFIG.NUM_MI 1 \
  CONFIG.S00_HAS_REGSLICE 4 \
  CONFIG.S01_HAS_REGSLICE 4 \
  CONFIG.S02_HAS_REGSLICE 4 \
  CONFIG.S03_HAS_REGSLICE 4 \
  CONFIG.S04_HAS_REGSLICE 4 \
  CONFIG.S05_HAS_REGSLICE 4 \
  CONFIG.S06_HAS_REGSLICE 4 \
  CONFIG.S07_HAS_REGSLICE 4 \
  CONFIG.S08_HAS_REGSLICE 4 \
  CONFIG.S09_HAS_REGSLICE 4 \
  CONFIG.S10_HAS_REGSLICE 4 \
  CONFIG.S11_HAS_REGSLICE 4 \
  CONFIG.S12_HAS_REGSLICE 4 \
  CONFIG.S13_HAS_REGSLICE 4 \
  CONFIG.S14_HAS_REGSLICE 4 \
  CONFIG.S15_HAS_REGSLICE 4 \
  CONFIG.SLR_ASSIGNMENTS SLR0 \
] [get_bd_cells ict_axi_ctrl_mgmt_00]
create_bd_cell -type ip -vlnv xilinx.com:ip:axi_interconnect:2.1 ict_axi_ctrl_mgmt_01
set_property -dict [list \
  CONFIG.M00_HAS_REGSLICE 4 \
  CONFIG.M01_HAS_REGSLICE 4 \
  CONFIG.M02_HAS_REGSLICE 4 \
  CONFIG.M03_HAS_REGSLICE 4 \
  CONFIG.M04_HAS_REGSLICE 4 \
  CONFIG.M05_HAS_REGSLICE 4 \
  CONFIG.M06_HAS_REGSLICE 4 \
  CONFIG.M07_HAS_REGSLICE 4 \
  CONFIG.M08_HAS_REGSLICE 4 \
  CONFIG.M09_HAS_REGSLICE 4 \
  CONFIG.M10_HAS_REGSLICE 4 \
  CONFIG.M11_HAS_REGSLICE 4 \
  CONFIG.M12_HAS_REGSLICE 4 \
  CONFIG.M13_HAS_REGSLICE 4 \
  CONFIG.M14_HAS_REGSLICE 4 \
  CONFIG.M15_HAS_REGSLICE 4 \
  CONFIG.M16_HAS_REGSLICE 4 \
  CONFIG.M17_HAS_REGSLICE 4 \
  CONFIG.M18_HAS_REGSLICE 4 \
  CONFIG.M19_HAS_REGSLICE 4 \
  CONFIG.M20_HAS_REGSLICE 4 \
  CONFIG.M21_HAS_REGSLICE 4 \
  CONFIG.M22_HAS_REGSLICE 4 \
  CONFIG.M23_HAS_REGSLICE 4 \
  CONFIG.M24_HAS_REGSLICE 4 \
  CONFIG.M25_HAS_REGSLICE 4 \
  CONFIG.M26_HAS_REGSLICE 4 \
  CONFIG.M27_HAS_REGSLICE 4 \
  CONFIG.M28_HAS_REGSLICE 4 \
  CONFIG.M29_HAS_REGSLICE 4 \
  CONFIG.M30_HAS_REGSLICE 4 \
  CONFIG.M31_HAS_REGSLICE 4 \
  CONFIG.M32_HAS_REGSLICE 4 \
  CONFIG.M33_HAS_REGSLICE 4 \
  CONFIG.M34_HAS_REGSLICE 4 \
  CONFIG.M35_HAS_REGSLICE 4 \
  CONFIG.M36_HAS_REGSLICE 4 \
  CONFIG.M37_HAS_REGSLICE 4 \
  CONFIG.M38_HAS_REGSLICE 4 \
  CONFIG.M39_HAS_REGSLICE 4 \
  CONFIG.M40_HAS_REGSLICE 4 \
  CONFIG.M41_HAS_REGSLICE 4 \
  CONFIG.M42_HAS_REGSLICE 4 \
  CONFIG.M43_HAS_REGSLICE 4 \
  CONFIG.M44_HAS_REGSLICE 4 \
  CONFIG.M45_HAS_REGSLICE 4 \
  CONFIG.M46_HAS_REGSLICE 4 \
  CONFIG.M47_HAS_REGSLICE 4 \
  CONFIG.M48_HAS_REGSLICE 4 \
  CONFIG.M49_HAS_REGSLICE 4 \
  CONFIG.M50_HAS_REGSLICE 4 \
  CONFIG.M51_HAS_REGSLICE 4 \
  CONFIG.M52_HAS_REGSLICE 4 \
  CONFIG.M53_HAS_REGSLICE 4 \
  CONFIG.M54_HAS_REGSLICE 4 \
  CONFIG.M55_HAS_REGSLICE 4 \
  CONFIG.M56_HAS_REGSLICE 4 \
  CONFIG.M57_HAS_REGSLICE 4 \
  CONFIG.M58_HAS_REGSLICE 4 \
  CONFIG.M59_HAS_REGSLICE 4 \
  CONFIG.M60_HAS_REGSLICE 4 \
  CONFIG.M61_HAS_REGSLICE 4 \
  CONFIG.M62_HAS_REGSLICE 4 \
  CONFIG.M63_HAS_REGSLICE 4 \
  CONFIG.NUM_MI 4 \
  CONFIG.S00_HAS_REGSLICE 4 \
  CONFIG.S01_HAS_REGSLICE 4 \
  CONFIG.S02_HAS_REGSLICE 4 \
  CONFIG.S03_HAS_REGSLICE 4 \
  CONFIG.S04_HAS_REGSLICE 4 \
  CONFIG.S05_HAS_REGSLICE 4 \
  CONFIG.S06_HAS_REGSLICE 4 \
  CONFIG.S07_HAS_REGSLICE 4 \
  CONFIG.S08_HAS_REGSLICE 4 \
  CONFIG.S09_HAS_REGSLICE 4 \
  CONFIG.S10_HAS_REGSLICE 4 \
  CONFIG.S11_HAS_REGSLICE 4 \
  CONFIG.S12_HAS_REGSLICE 4 \
  CONFIG.S13_HAS_REGSLICE 4 \
  CONFIG.S14_HAS_REGSLICE 4 \
  CONFIG.S15_HAS_REGSLICE 4 \
  CONFIG.SLR_ASSIGNMENTS SLR2 \
] [get_bd_cells ict_axi_ctrl_mgmt_01]
create_bd_cell -type ip -vlnv xilinx.com:ip:axi_interconnect:2.1 ict_axi_ctrl_user_00
